# Altium project 扩展.PrjPCB (part 2 of 2)

## Sheet 十六继电器.SchDoc: 阿波罗十六继电器控制器
size A4; Revision: V1.1; SheetNumber: 0; SheetTotal: 0
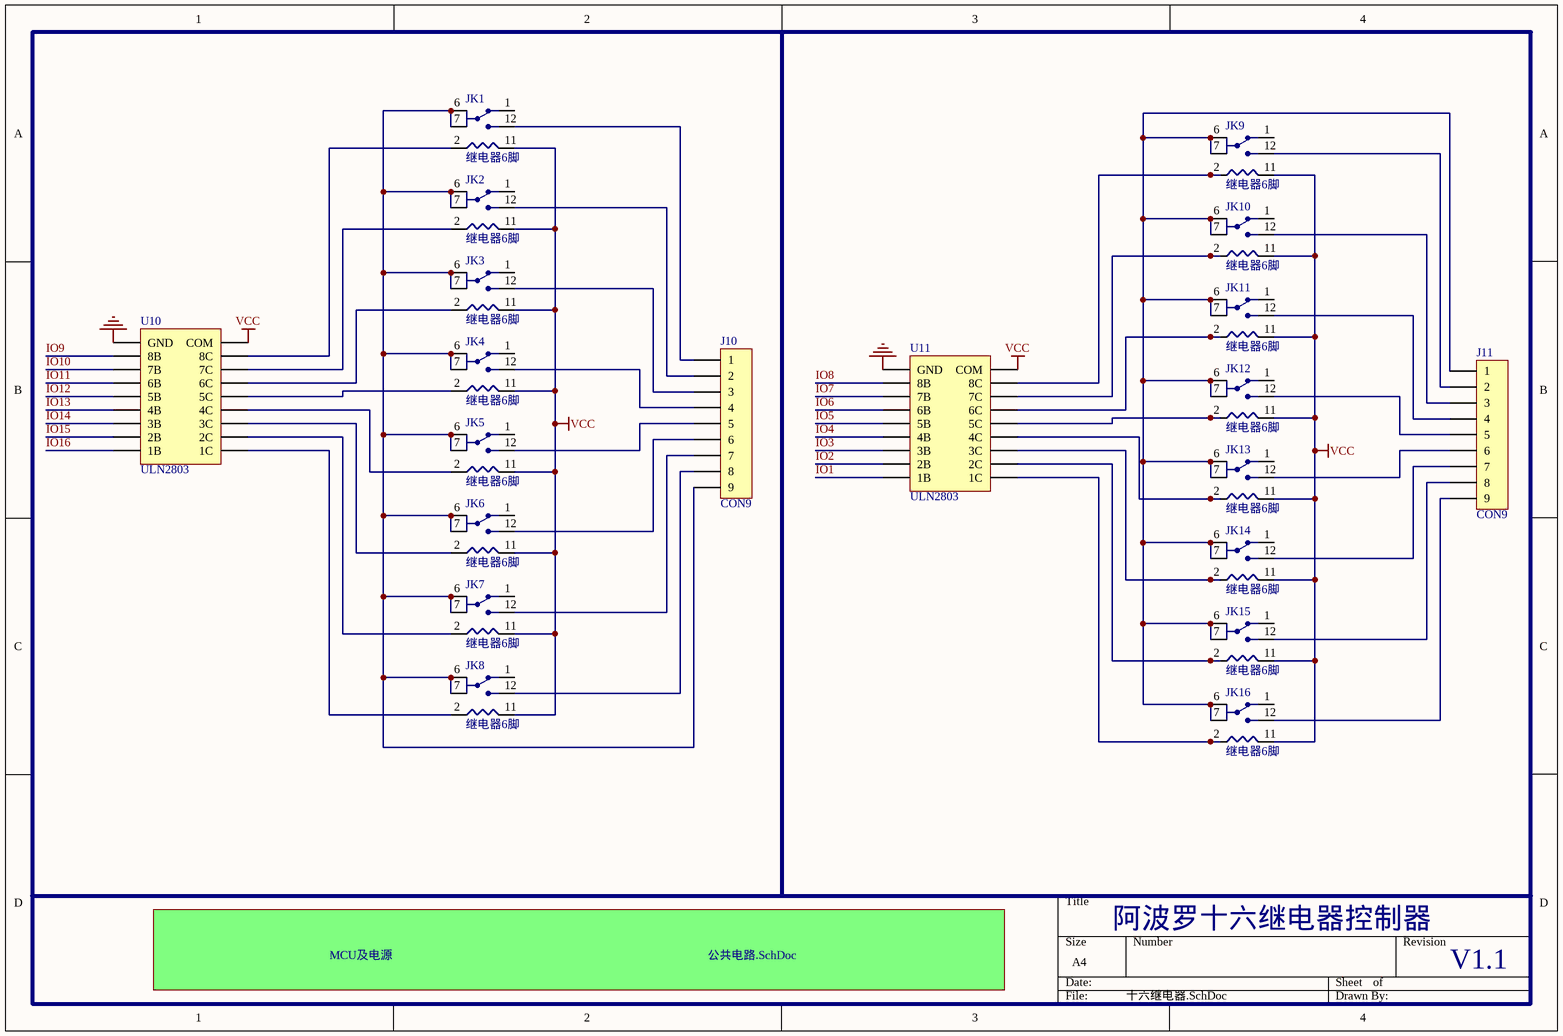
[diagram p8: 十六继电器.SchDoc]

### Parts
(Parts that share a designator on the sheet are numbered #1, #2 ... from top to bottom, then left to right.)
J10#4  CON9  [CON9*5.1]
J11#4  CON9  [CON9*5.1]
JK1  继电器6脚  [RL]
JK2  继电器6脚  [RL]
JK3  继电器6脚  [RL]
JK4  继电器6脚  [RL]
JK5  继电器6脚  [RL]
JK6  继电器6脚  [RL]
JK7  继电器6脚  [RL]
JK8  继电器6脚  [RL]
JK9  继电器6脚  [RL]
JK10  继电器6脚  [RL]
JK11  继电器6脚  [RL]
JK12  继电器6脚  [RL]
JK13  继电器6脚  [RL]
JK14  继电器6脚  [RL]
JK15  继电器6脚  [RL]
JK16  继电器6脚  [RL]
U10#3  ULN2803  [sol18]
U11#3  ULN2803  [sol18]

### Sub-sheets
MCU及电源 = 公共电路.SchDoc: no entries

### Nets
GND: U10#3.9(GND) U11#3.9(GND)
VCC: JK1.11 JK2.11 JK3.11 JK4.11 JK5.11 JK6.11 JK7.11 JK8.11 JK9.11 JK10.11 JK11.11 JK12.11 JK13.11 JK14.11 JK15.11 JK16.11 U10#3.10(COM) U11#3.10(COM)
IO1: U11#3.1(1B)
IO2: U11#3.2(2B)
IO3: U11#3.3(3B)
IO4: U11#3.4(4B)
IO5: U11#3.5(5B)
IO6: U11#3.6(6B)
IO7: U11#3.7(7B)
IO8: U11#3.8(8B)
IO9: U10#3.8(8B)
IO10: U10#3.7(7B)
IO11: U10#3.6(6B)
IO12: U10#3.5(5B)
IO13: U10#3.4(4B)
IO14: U10#3.3(3B)
IO15: U10#3.2(2B)
IO16: U10#3.1(1B)
NetJ10#4_1: J10#4.1 JK1.12
NetJ10#4_2: J10#4.2 JK2.12
NetJ10#4_3: J10#4.3 JK3.12
NetJ10#4_4: J10#4.4 JK4.12
NetJ10#4_5: J10#4.5 JK5.12
NetJ10#4_6: J10#4.6 JK6.12
NetJ10#4_7: J10#4.7 JK7.12
NetJ10#4_8: J10#4.8 JK8.12
NetJ10#4_9: J10#4.9 JK1.6 JK1.7 JK2.6 JK2.7 JK3.6 JK3.7 JK4.6 JK4.7 JK5.6 JK5.7 JK6.6 JK6.7 JK7.6 JK7.7 JK8.6 JK8.7
NetJ11#4_1: J11#4.1 JK9.6 JK9.7 JK10.6 JK10.7 JK11.6 JK11.7 JK12.6 JK12.7 JK13.6 JK13.7 JK14.6 JK14.7 JK15.6 JK15.7 JK16.6 JK16.7
NetJ11#4_2: J11#4.2 JK9.12
NetJ11#4_3: J11#4.3 JK10.12
NetJ11#4_4: J11#4.4 JK11.12
NetJ11#4_5: J11#4.5 JK12.12
NetJ11#4_6: J11#4.6 JK13.12
NetJ11#4_7: J11#4.7 JK14.12
NetJ11#4_8: J11#4.8 JK15.12
NetJ11#4_9: J11#4.9 JK16.12
NetJK1_2: JK1.2 U10#3.11(8C)
NetJK2_2: JK2.2 U10#3.12(7C)
NetJK3_2: JK3.2 U10#3.13(6C)
NetJK4_2: JK4.2 U10#3.14(5C)
NetJK5_2: JK5.2 U10#3.15(4C)
NetJK6_2: JK6.2 U10#3.16(3C)
NetJK7_2: JK7.2 U10#3.17(2C)
NetJK8_2: JK8.2 U10#3.18(1C)
NetJK9_2: JK9.2 U11#3.11(8C)
NetJK10_2: JK10.2 U11#3.12(7C)
NetJK11_2: JK11.2 U11#3.13(6C)
NetJK12_2: JK12.2 U11#3.14(5C)
NetJK13_2: JK13.2 U11#3.15(4C)
NetJK14_2: JK14.2 U11#3.16(3C)
NetJK15_2: JK15.2 U11#3.17(2C)
NetJK16_2: JK16.2 U11#3.18(1C)

Not connected (* = marked no-connect by the designer): JK1 1; JK2 1; JK3 1; JK4 1; JK5 1; JK6 1; JK7 1; JK8 1; JK9 1; JK10 1; JK11 1; JK12 1; JK13 1; JK14 1; JK15 1; JK16 1

## Sheet 电机控制.SchDoc: 阿波罗工业控制器四电机六进六出控制器电路
size A4; Revision: V1.4; SheetNumber: 0; SheetTotal: 0
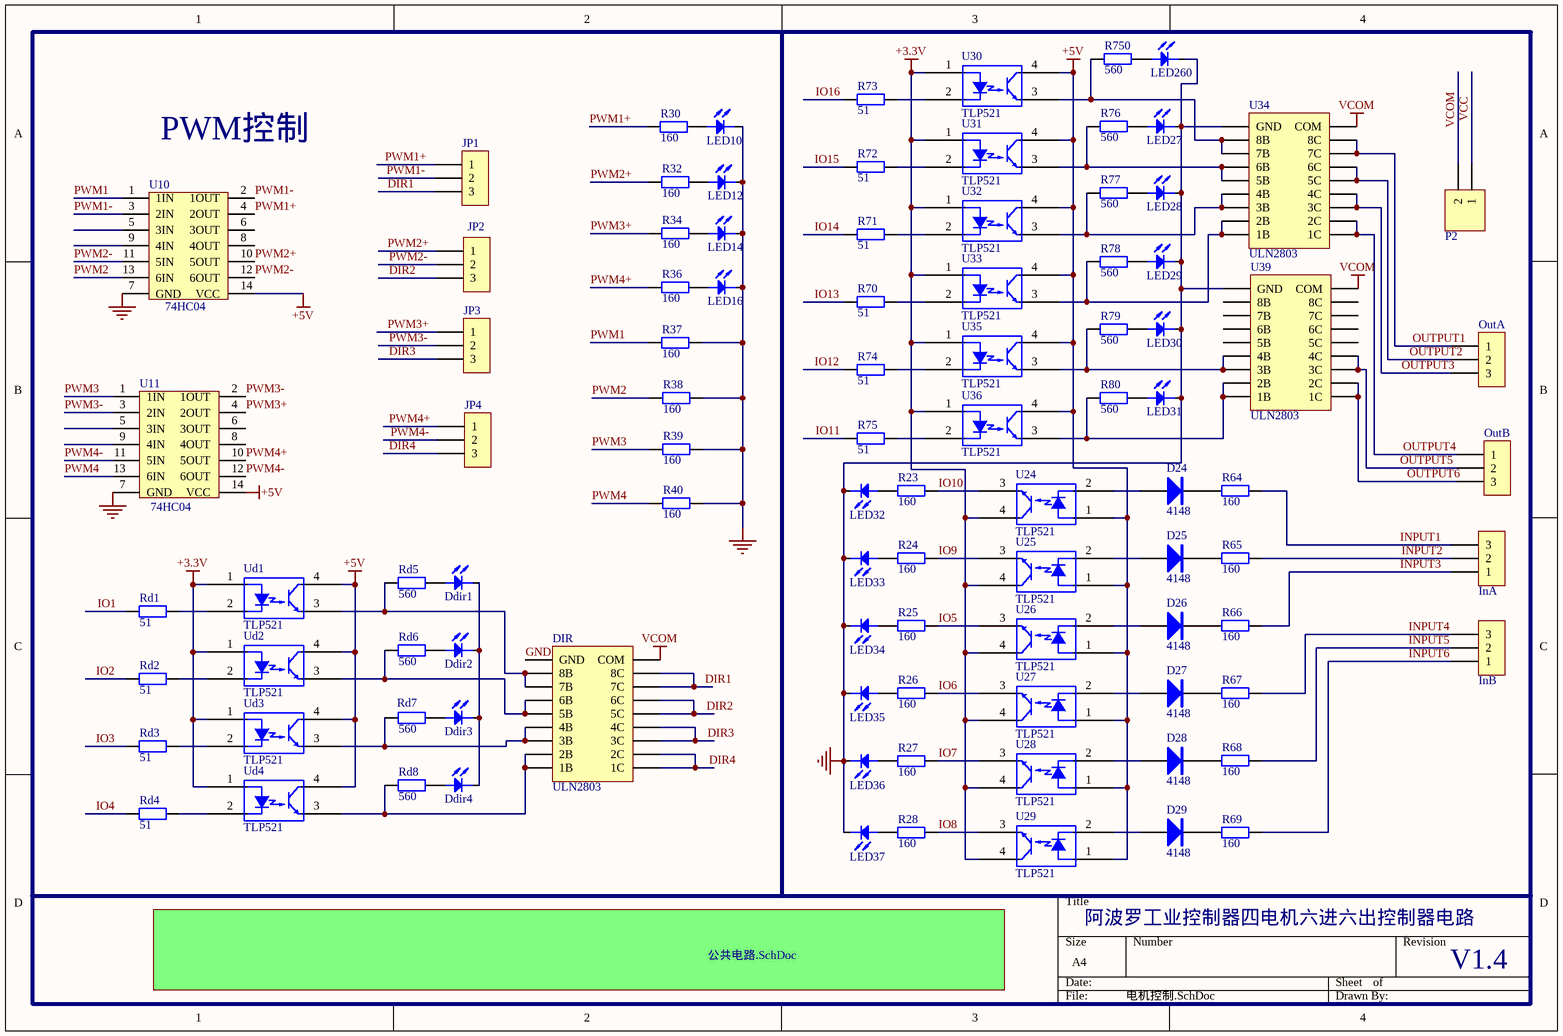
[diagram p9: 电机控制.SchDoc]

### Parts
(Parts that share a designator on the sheet are numbered #1, #2 ... from top to bottom, then left to right.)
D24#2  4148
D25#2  4148
D26#2  4148
D27#2  4148
D28#1  4148
D29#1  4148
Ddir1  LED  [SMDLED]  (value not drawn)
Ddir2  LED  [SMDLED]  (value not drawn)
Ddir3  LED  [SMDLED]  (value not drawn)
Ddir4  LED  [SMDLED]  (value not drawn)
DIR  ULN2803  [sol18]
InA  CON3  (value not drawn)
InB  CON3  (value not drawn)
JP1  CON3  (value not drawn)
JP2  CON3  (value not drawn)
JP3  CON3  (value not drawn)
JP4  CON3  (value not drawn)
LED10#4  LED  [SMDLED]  (value not drawn)
LED12#4  LED  [SMDLED]  (value not drawn)
LED14#4  LED  [SMDLED]  (value not drawn)
LED16#4  LED  [SMDLED]  (value not drawn)
LED27  LED  [SMDLED]  (value not drawn)
LED28  LED  [SMDLED]  (value not drawn)
LED29  LED  [SMDLED]  (value not drawn)
LED30#4  LED  [SMDLED]  (value not drawn)
LED31#4  LED  [SMDLED]  (value not drawn)
LED32#4  LED  [SMDLED]  (value not drawn)
LED33#4  LED  [SMDLED]  (value not drawn)
LED34#4  LED  [SMDLED]  (value not drawn)
LED35#4  LED  [SMDLED]  (value not drawn)
LED36#4  LED  [SMDLED]  (value not drawn)
LED37#4  LED  [SMDLED]  (value not drawn)
LED260  LED  [SMDLED]  (value not drawn)
OutA  CON3  (value not drawn)
OutB  CON3  (value not drawn)
P2#1  (no value)  [HDR1X2]
R23#4  160  [0603A]
R24#4  160  [0603A]
R25#4  160  [0603A]
R26#4  160  [0603A]
R27#4  160  [0603A]
R28#4  160  [0603A]
R30#4  160  [0603A]
R32#4  160  [0603A]
R34#4  160  [0603A]
R36#4  160  [0603A]
R37#4  160  [0603A]
R38#2  160  [0603A]
R39#2  160  [0603A]
R40#1  160  [0603A]
R64#2  160  [0603A]
R65#2  160  [0603A]
R66#2  160  [0603A]
R67#2  160  [0603A]
R68#1  160  [0603A]
R69#1  160  [0603A]
R70#3  51  [0603A]
R71#3  51  [0603A]
R72#3  51  [0603A]
R73#3  51  [0603A]
R74#3  51  [0603A]
R75#3  51  [0603A]
R76#3  560  [0603A]
R77#3  560  [0603A]
R78  560  [0603A]
R79  560  [0603A]
R80#2  560  [0603A]
R750  560  [0603A]
Rd1  51  [0603A]
Rd2  51  [0603A]
Rd3  51  [0603A]
Rd4  51  [0603A]
Rd5  560  [0603A]
Rd6  560  [0603A]
Rd7  560  [0603A]
Rd8  560  [0603A]
U10#4  74HC04  [so-14]
U11#4  74HC04  [so-14]
U24#2  TLP521  [PC817]
U25#2  TLP521  [PC817]
U26#2  TLP521  [PC817]
U27#2  TLP521  [PC817]
U28#1  TLP521  [PC817]
U29#1  TLP521  [PC817]
U30#3  TLP521  [PC817]
U31#3  TLP521  [PC817]
U32#3  TLP521  [PC817]
U33#3  TLP521  [PC817]
U34#3  ULN2803  [sol18]
U35#3  TLP521  [PC817]
U36#3  TLP521  [PC817]
U39#3  ULN2803  [sol18]
Ud1  TLP521  [PC817]
Ud2  TLP521  [PC817]
Ud3  TLP521  [PC817]
Ud4  TLP521  [PC817]

### Sub-sheets
? = 公共电路.SchDoc: no entries

### Nets
+3.3V: U24#2.4(COL) U25#2.4(COL) U26#2.4(COL) U27#2.4(COL) U28#1.4(COL) U29#1.4(COL) U30#3.1(ANODE) U31#3.1(ANODE) U32#3.1(ANODE) U33#3.1(ANODE) U35#3.1(ANODE) U36#3.1(ANODE) Ud1.1(ANODE) Ud2.1(ANODE) Ud3.1(ANODE) Ud4.1(ANODE)
+5V: U10#4.14(VCC) U11#4.14(VCC) U24#2.1(ANODE) U25#2.1(ANODE) U26#2.1(ANODE) U27#2.1(ANODE) U28#1.1(ANODE) U29#1.1(ANODE) U30#3.4(COL) U31#3.4(COL) U32#3.4(COL) U33#3.4(COL) U35#3.4(COL) U36#3.4(COL) Ud1.4(COL) Ud2.4(COL) Ud3.4(COL) Ud4.4(COL)
GND: DIR.9(GND) LED10#4.K LED12#4.K LED14#4.K LED16#4.K LED27.K LED28.K LED29.K LED30#4.K LED31#4.K LED32#4.K LED33#4.K LED34#4.K LED35#4.K LED36#4.K LED37#4.K LED260.K R37#4.2 R38#2.2 R39#2.2 R40#1.2 U10#4.7(GND) U11#4.7(GND) U34#3.9(GND) U39#3.9(GND)
VCC: P2#1.1
VCOM: DIR.10(COM) P2#1.2 U34#3.10(COM) U39#3.10(COM)
DIR1: DIR.11(8C) DIR.12(7C) JP1.3
DIR2: DIR.13(6C) DIR.14(5C) JP2.3
DIR3: DIR.15(4C) DIR.16(3C) JP3.3
DIR4: DIR.17(2C) DIR.18(1C) JP4.3
INPUT1: InA.3 R64#2.2
INPUT2: InA.2 R65#2.2
INPUT3: InA.1 R66#2.2
INPUT4: InB.3 R67#2.2
INPUT5: InB.2 R68#1.2
INPUT6: InB.1 R69#1.2
IO1: Rd1.1
IO2: Rd2.1
IO3: Rd3.1
IO4: Rd4.1
IO5: R25#4.1 U26#2.3(EMIT)
IO6: R26#4.1 U27#2.3(EMIT)
IO7: R27#4.1 U28#1.3(EMIT)
IO8: R28#4.1 U29#1.3(EMIT)
IO9: R24#4.1 U25#2.3(EMIT)
IO10: R23#4.1 U24#2.3(EMIT)
IO11: R75#3.1
IO12: R74#3.1
IO13: R70#3.1
IO14: R71#3.1
IO15: R72#3.1
IO16: R73#3.1
OUTPUT1: OutA.1 U34#3.11(8C) U34#3.12(7C)
OUTPUT2: OutA.2 U34#3.13(6C) U34#3.14(5C)
OUTPUT3: OutA.3 U34#3.15(4C) U34#3.16(3C)
OUTPUT4: OutB.1 U34#3.17(2C) U34#3.18(1C)
OUTPUT5: OutB.2 U39#3.15(4C) U39#3.16(3C)
OUTPUT6: OutB.3 U39#3.17(2C) U39#3.18(1C)
PWM1: R37#4.1 U10#4.1(1IN)
PWM1+: JP1.1 R30#4.1 U10#4.4(2OUT)
PWM1-: JP1.2 U10#4.2(1OUT) U10#4.3(2IN)
PWM2: R38#2.1 U10#4.13(6IN)
PWM2+: JP2.1 R32#4.1 U10#4.10(5OUT)
PWM2-: JP2.2 U10#4.11(5IN) U10#4.12(6OUT)
PWM3: R39#2.1 U11#4.1(1IN)
PWM3+: JP3.1 R34#4.1 U11#4.4(2OUT)
PWM3-: JP3.2 U11#4.2(1OUT) U11#4.3(2IN)
PWM4: R40#1.1 U11#4.13(6IN)
PWM4+: JP4.1 R36#4.1 U11#4.10(5OUT)
PWM4-: JP4.2 U11#4.11(5IN) U11#4.12(6OUT)
NetD24#2_A: D24#2.A U24#2.2(CATH)
NetD24#2_K: D24#2.K R64#2.1
NetD25#2_A: D25#2.A U25#2.2(CATH)
NetD25#2_K: D25#2.K R65#2.1
NetD26#2_A: D26#2.A U26#2.2(CATH)
NetD26#2_K: D26#2.K R66#2.1
NetD27#2_A: D27#2.A U27#2.2(CATH)
NetD27#2_K: D27#2.K R67#2.1
NetD28#1_A: D28#1.A U28#1.2(CATH)
NetD28#1_K: D28#1.K R68#1.1
NetD29#1_A: D29#1.A U29#1.2(CATH)
NetD29#1_K: D29#1.K R69#1.1
NetDdir1_A: Ddir1.A Rd5.2
NetDdir1_K: Ddir1.K Ddir2.K Ddir3.K Ddir4.K
NetDdir2_A: Ddir2.A Rd6.2
NetDdir3_A: Ddir3.A Rd7.2
NetDdir4_A: Ddir4.A Rd8.2
NetDIR_1: DIR.1(1B) DIR.2(2B) Rd8.1 Ud4.3(EMIT)
NetDIR_3: DIR.3(3B) DIR.4(4B) Rd7.1 Ud3.3(EMIT)
NetDIR_5: DIR.5(5B) DIR.6(6B) Rd6.1 Ud2.3(EMIT)
NetDIR_7: DIR.7(7B) DIR.8(8B) Rd5.1 Ud1.3(EMIT)
NetLED10#4_A: LED10#4.A R30#4.2
NetLED12#4_A: LED12#4.A R32#4.2
NetLED14#4_A: LED14#4.A R34#4.2
NetLED16#4_A: LED16#4.A R36#4.2
NetLED27_A: LED27.A R76#3.2
NetLED28_A: LED28.A R77#3.2
NetLED29_A: LED29.A R78.2
NetLED30#4_A: LED30#4.A R79.2
NetLED31#4_A: LED31#4.A R80#2.2
NetLED32#4_A: LED32#4.A R23#4.2
NetLED33#4_A: LED33#4.A R24#4.2
NetLED34#4_A: LED34#4.A R25#4.2
NetLED35#4_A: LED35#4.A R26#4.2
NetLED36#4_A: LED36#4.A R27#4.2
NetLED37#4_A: LED37#4.A R28#4.2
NetLED260_A: LED260.A R750.2
NetR70#3_2: R70#3.2 U33#3.2(CATH)
NetR71#3_2: R71#3.2 U32#3.2(CATH)
NetR72#3_2: R72#3.2 U31#3.2(CATH)
NetR73#3_2: R73#3.2 U30#3.2(CATH)
NetR74#3_2: R74#3.2 U35#3.2(CATH)
NetR75#3_2: R75#3.2 U36#3.2(CATH)
NetR76#3_1: R76#3.1 U31#3.3(EMIT) U34#3.5(5B) U34#3.6(6B)
NetR77#3_1: R77#3.1 U32#3.3(EMIT) U34#3.3(3B) U34#3.4(4B)
NetR78_1: R78.1 U33#3.3(EMIT) U34#3.1(1B) U34#3.2(2B)
NetR79_1: R79.1 U35#3.3(EMIT) U39#3.3(3B) U39#3.4(4B)
NetR80#2_1: R80#2.1 U36#3.3(EMIT) U39#3.1(1B) U39#3.2(2B)
NetR750_1: R750.1 U30#3.3(EMIT) U34#3.7(7B) U34#3.8(8B)
NetRd1_2: Rd1.2 Ud1.2(CATH)
NetRd2_2: Rd2.2 Ud2.2(CATH)
NetRd3_2: Rd3.2 Ud3.2(CATH)
NetRd4_2: Rd4.2 Ud4.2(CATH)

Not connected (* = marked no-connect by the designer): U10#4 5(3IN) 6(3OUT) 8(4OUT) 9(4IN); U11#4 5(3IN) 6(3OUT) 8(4OUT) 9(4IN); U39#3 5(5B) 6(6B) 7(7B) 8(8B) 11(8C) 12(7C) 13(6C) 14(5C)

### Notes on the sheet
- (near U10#4) PWM控制

### Library data of the parts
P2#1 = Header 2: Header, 2-Pin; LatestRevisionDate: 17-Jul-2002; LatestRevisionNote: Re-released for DXP Platform.; Publisher: Altium Limited
R23#4 R24#4 R25#4 R26#4 R27#4 R28#4 R30#4 R32#4 R34#4 R36#4 R37#4 R38#2 R39#2 R40#1 R64#2 R65#2 R66#2 R67#2 R68#1 R69#1 R70#3 R71#3 R72#3 R73#3 R74#3 R75#3 R76#3 R77#3 R78 R79 R80#2 R750 Rd1-Rd8 = Res2: Resistor; Value: 1K; Published: 8-Jun-2000; LatestRevisionDate: 17-Jul-2002; LatestRevisionNote: Re-released for DXP Platform.; PackageReference: AXIAL-0.4; Publisher: Altium Limited
U24#2 U25#2 U26#2 U27#2 U28#1 U29#1 U30#3 U31#3 U32#3 U33#3 U35#3 U36#3 Ud1-Ud4 = TLP521-1: Single NPN PhotoTransistor OptoCoupler.

## Sheet 模拟量.SchDoc: 阿波罗模拟量控制器
size A4; Revision: V1.1; SheetNumber: 0; SheetTotal: 0
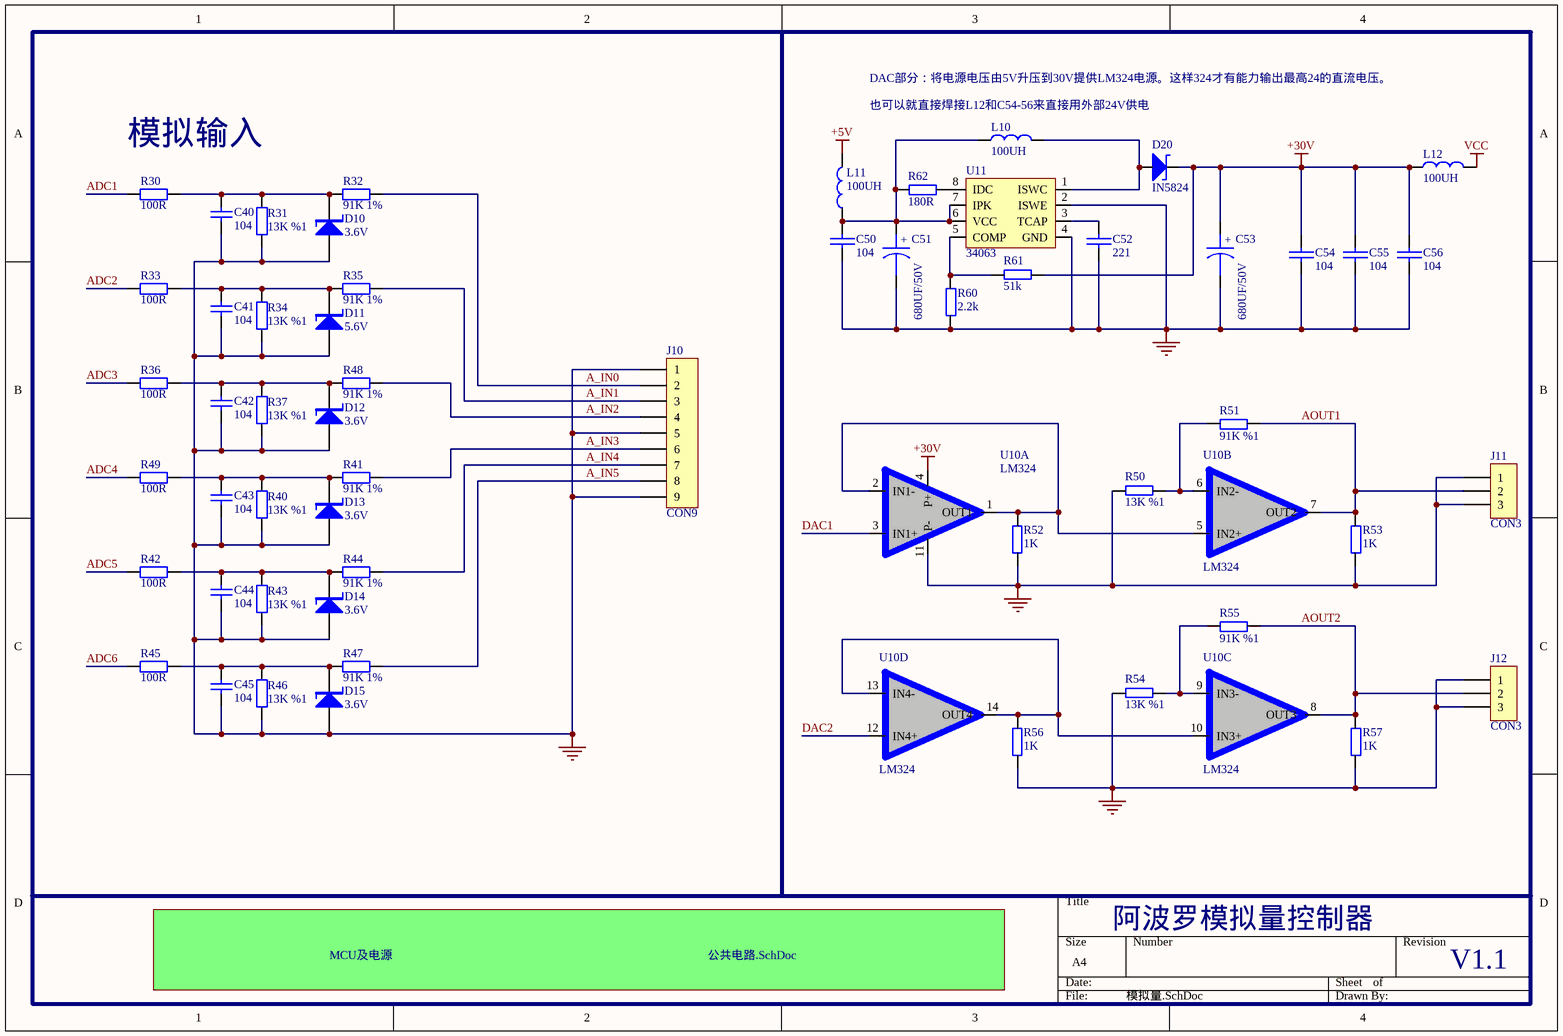
[diagram p10: 模拟量.SchDoc]

### Parts
(Parts that share a designator on the sheet are numbered #1, #2 ... from top to bottom, then left to right.)
C40  104  [0603A]
C41  104  [0603A]
C42  104  [0603A]
C43  104  [0603A]
C44  104  [0603A]
C45  104  [0603A]
C50  104  [0603A]
C51  680UF/50V  [电解电容]
C52  221  [0603A]
C53  680UF/50V  [电解电容]
C54  104  [0603A]
C55  104  [0603A]
C56  104  [0603A]
D10#3  3.6V  [贴片二极管]
D11#3  5.6V  [贴片二极管]
D12#3  3.6V  [贴片二极管]
D13#3  3.6V  [贴片二极管]
D14#3  3.6V  [贴片二极管]
D15#3  3.6V  [贴片二极管]
D20#2  IN5824  [贴片二极管]
J10#5  CON9  [CON9-5.1卧]
J11#5  CON3  [CON3-5.1卧]
J12  CON3  [CON3-5.1卧]
L10  100UH  [SMD-50]
L11  100UH  [1206C]
L12  100UH  [1206C]
R30#5  100R  [0603A]
R31#4  13K %1  [0603A]
R32#5  91K 1%  [0603A]
R33#4  100R  [0603A]
R34#5  13K %1  [0603A]
R35#4  91K 1%  [0603A]
R36#5  100R  [0603A]
R37#5  13K %1  [0603A]
R40#2  13K %1  [0603A]
R41  91K 1%  [0603A]
R42  100R  [0603A]
R43#1  13K %1  [0603A]
R44#1  91K 1%  [0603A]
R45#1  100R  [0603A]
R46#1  13K %1  [0603A]
R47#1  91K 1%  [0603A]
R48#1  91K 1%  [0603A]
R49#3  100R  [0603A]
R50#3  13K %1  [0603A]
R51#3  91K %1  [0603A]
R52#3  1K  [0603A]
R53#3  1K  [0603A]
R54#3  13K %1  [0603A]
R55#3  91K %1  [0603A]
R56#3  1K  [0603A]
R57#3  1K  [0603A]
R60#2  2.2k  [0603A]
R61#2  51k  [0603A]
R62#2  180R  [0603A]
U10#5  LM324  [SO-14]  (parts A,B,C,D of 4)
U11#5  34063  [SO8_L]

### Sub-sheets
MCU及电源 = 公共电路.SchDoc: no entries

### Nets
+5V: L11.1
+30V: C53.1 C54.1 C55.1 C56.1 D20#2.K L12.2 R61#2.1 U10#5.4(P+)
GND: C40.1 C41.1 C42.1 C43.1 C44.1 C45.1 C50.2 C51.2 C52.2 C53.2 C54.2 C55.2 C56.2 D10#3.A D11#3.A D12#3.A D13#3.A D14#3.A D15#3.A J10#5.1 J10#5.5 J10#5.9 J11#5.1 J11#5.3 J12.1 J12.3 R31#4.1 R34#5.1 R37#5.1 R40#2.1 R43#1.1 R46#1.1 R50#3.2 R52#3.2 R53#3.1 R54#3.2 R56#3.2 R57#3.1 R60#2.1 U10#5.11(P-) U11#5.2(ISWE) U11#5.4(GND)
VCC: L12.1
A_IN0: J10#5.2 R32#5.1
A_IN1: J10#5.3 R35#4.1
A_IN2: J10#5.4 R48#1.1
A_IN3: J10#5.6 R41.1
A_IN4: J10#5.7 R44#1.1
A_IN5: J10#5.8 R47#1.1
ADC1: R30#5.1
ADC2: R33#4.1
ADC3: R36#5.1
ADC4: R49#3.1
ADC5: R42.1
ADC6: R45#1.1
AOUT1: J11#5.2 R51#3.2 R53#3.2 U10#5.7(OUT2)
AOUT2: J12.2 R55#3.2 R57#3.2 U10#5.8(OUT3)
DAC1: U10#5.3(IN1+)
DAC2: U10#5.12(IN4+)
NetC40_2: C40.2 D10#3.K R30#5.2 R31#4.2 R32#5.2
NetC41_2: C41.2 D11#3.K R33#4.2 R34#5.2 R35#4.2
NetC42_2: C42.2 D12#3.K R36#5.2 R37#5.2 R48#1.2
NetC43_2: C43.2 D13#3.K R40#2.2 R41.2 R49#3.2
NetC44_2: C44.2 D14#3.K R42.2 R43#1.2 R44#1.2
NetC45_2: C45.2 D15#3.K R45#1.2 R46#1.2 R47#1.2
NetC50_1: C50.1 C51.1 L10.2 L11.2 R62#2.1 U11#5.6(VCC) U11#5.7(IPK)
NetC52_1: C52.1 U11#5.3(TCAP)
NetD20#2_A: D20#2.A L10.1 U11#5.1(ISWC)
NetR50#3_1: R50#3.1 R51#3.1 U10#5.6(IN2-)
NetR52#3_1: R52#3.1 U10#5.1(OUT1) U10#5.2(IN1-) U10#5.5(IN2+)
NetR54#3_1: R54#3.1 R55#3.1 U10#5.9(IN3-)
NetR56#3_1: R56#3.1 U10#5.10(IN3+) U10#5.13(IN4-) U10#5.14(OUT4)
NetR60#2_2: R60#2.2 R61#2.2 U11#5.5(COMP)
NetR62#2_2: R62#2.2 U11#5.8(IDC)

### Notes on the sheet
- DAC部分：将电源电压由5V升压到30V提供LM324电源。这样324才有能力输出最高24的直流电压。
- (near L10) 也可以就直接焊接L12和C54-56来直接用外部24V供电
- 模拟输入
- (in symbol CAPACITOR POL) +

### Library data of the parts
C40-C45 = Cap_1: Capacitor; Value: 100pF; Published: 8-Jun-2000; LatestRevisionDate: 17-Jul-2002; LatestRevisionNote: Re-released for DXP Platform.; PackageReference: RAD-0.3; Publisher: Altium Limited
C50 C52 C54-C56 = CAP: Capacitor
C51 C53 = CAPACITOR POL: Capacitor
D10#3 D11#3 D12#3 D13#3 D14#3 D15#3 = 稳压二极管
D20#2 = 肖特基二极管
L10-L12 = L1
R30#5 R31#4 R32#5 R33#4 R34#5 R35#4 R36#5 R37#5 R40#2 R41 R42 R43#1 R44#1 R45#1 R46#1 R47#1 R48#1 R49#3 = Res2: Resistor; Value: 1K; Published: 8-Jun-2000; LatestRevisionDate: 17-Jul-2002; LatestRevisionNote: Re-released for DXP Platform.; PackageReference: AXIAL-0.4; Publisher: Altium Limited
R50#3 R51#3 R52#3 R53#3 R54#3 R55#3 R56#3 R57#3 R60#2 R61#2 R62#2 = R

## Sheet 四进四出三电机.SchDoc: 阿波罗混胶机控制器
size A4; Revision: V1.2; SheetNumber: 0; SheetTotal: 0
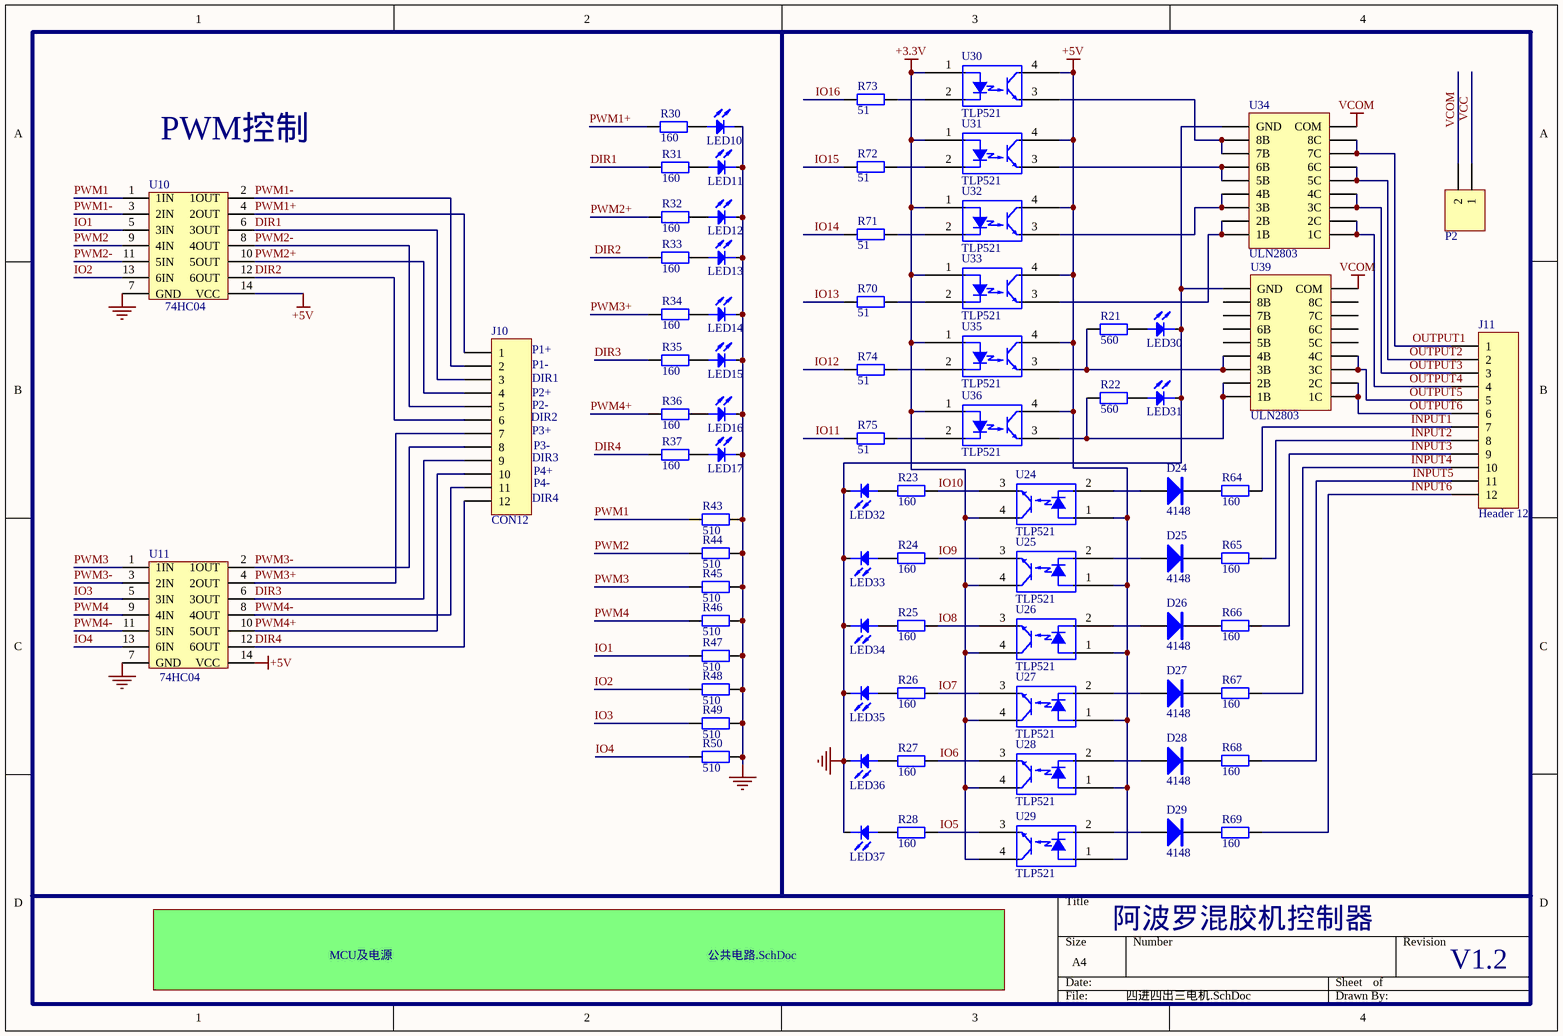
[diagram p11: 四进四出三电机.SchDoc]

### Parts
(Parts that share a designator on the sheet are numbered #1, #2 ... from top to bottom, then left to right.)
D24#3  4148  [贴片二极管]
D25#3  4148  [贴片二极管]
D26#3  4148  [贴片二极管]
D27#3  4148  [贴片二极管]
D28#2  4148  [贴片二极管]
D29#2  4148  [贴片二极管]
J10#6  CON12  [CON12-5.1卧]
J11#6  Header 12  [CON12-5.1卧]
LED10#5  LED  [LED2.5]  (value not drawn)
LED11#4  LED  [LED2.5]  (value not drawn)
LED12#5  LED  [LED2.5]  (value not drawn)
LED13#4  LED  [LED2.5]  (value not drawn)
LED14#5  LED  [LED2.5]  (value not drawn)
LED15#4  LED  [LED2.5]  (value not drawn)
LED16#5  LED  [LED2.5]  (value not drawn)
LED17#4  LED  [LED2.5]  (value not drawn)
LED30#5  LED  [LED2.5]  (value not drawn)
LED31#5  LED  [LED2.5]  (value not drawn)
LED32#5  LED  [LED2.5]  (value not drawn)
LED33#5  LED  [LED2.5]  (value not drawn)
LED34#5  LED  [LED2.5]  (value not drawn)
LED35#5  LED  [LED2.5]  (value not drawn)
LED36#5  LED  [LED2.5]  (value not drawn)
LED37#5  LED  [LED2.5]  (value not drawn)
P2#2  (no value)  [HDR1X2]
R21#5  560  [0603A]
R22#4  560  [0603A]
R23#5  160  [0603A]
R24#5  160  [0603A]
R25#5  160  [0603A]
R26#5  160  [0603A]
R27#5  160  [0603A]
R28#5  160  [0603A]
R30#6  160  [0603A]
R31#5  160  [0603A]
R32#6  160  [0603A]
R33#5  160  [0603A]
R34#6  160  [0603A]
R35#5  160  [0603A]
R36#6  160  [0603A]
R37#6  160  [0603A]
R43#2  510  [0603A]
R44#2  510  [0603A]
R45#2  510  [0603A]
R46#2  510  [0603A]
R47#2  510  [0603A]
R48#2  510  [0603A]
R49#4  510  [0603A]
R50#4  510  [0603A]
R64#3  160  [0603A]
R65#3  160  [0603A]
R66#3  160  [0603A]
R67#3  160  [0603A]
R68#2  160  [0603A]
R69#2  160  [0603A]
R70#4  51  [0603A]
R71#4  51  [0603A]
R72#4  51  [0603A]
R73#4  51  [0603A]
R74#4  51  [0603A]
R75#4  51  [0603A]
U10#6  74HC04  [so-14]
U11#6  74HC04  [so-14]
U24#3  TLP521  [PC817]
U25#3  TLP521  [PC817]
U26#3  TLP521  [PC817]
U27#3  TLP521  [PC817]
U28#2  TLP521  [PC817]
U29#2  TLP521  [PC817]
U30#4  TLP521  [PC817]
U31#4  TLP521  [PC817]
U32#4  TLP521  [PC817]
U33#4  TLP521  [PC817]
U34#4  ULN2803  [sol18]
U35#4  TLP521  [PC817]
U36#4  TLP521  [PC817]
U39#4  ULN2803  [sol18]

### Sub-sheets
MCU及电源 = 公共电路.SchDoc: no entries

### Nets
+3.3V: U24#3.4(COL) U25#3.4(COL) U26#3.4(COL) U27#3.4(COL) U28#2.4(COL) U29#2.4(COL) U30#4.1(ANODE) U31#4.1(ANODE) U32#4.1(ANODE) U33#4.1(ANODE) U35#4.1(ANODE) U36#4.1(ANODE)
+5V: U10#6.14(VCC) U11#6.14(VCC) U24#3.1(ANODE) U25#3.1(ANODE) U26#3.1(ANODE) U27#3.1(ANODE) U28#2.1(ANODE) U29#2.1(ANODE) U30#4.4(COL) U31#4.4(COL) U32#4.4(COL) U33#4.4(COL) U35#4.4(COL) U36#4.4(COL)
GND: LED10#5.K LED11#4.K LED12#5.K LED13#4.K LED14#5.K LED15#4.K LED16#5.K LED17#4.K LED30#5.K LED31#5.K LED32#5.K LED33#5.K LED34#5.K LED35#5.K LED36#5.K LED37#5.K R43#2.2 R44#2.2 R45#2.2 R46#2.2 R47#2.2 R48#2.2 R49#4.2 R50#4.2 U10#6.7(GND) U11#6.7(GND) U34#4.9(GND) U39#4.9(GND)
VCC: P2#2.1
VCOM: P2#2.2 U34#4.10(COM) U39#4.10(COM)
DIR1: J10#6.3 R31#5.1 U10#6.6(3OUT)
DIR2: J10#6.6 R33#5.1 U10#6.12(6OUT)
DIR3: J10#6.9 R35#5.1 U11#6.6(3OUT)
DIR4: J10#6.12 R37#6.1 U11#6.12(6OUT)
INPUT1: J11#6.7 R64#3.2
INPUT2: J11#6.8 R65#3.2
INPUT3: J11#6.9 R66#3.2
INPUT4: J11#6.10 R67#3.2
INPUT5: J11#6.11 R68#2.2
INPUT6: J11#6.12 R69#2.2
IO1: R47#2.1 U10#6.5(3IN)
IO2: R48#2.1 U10#6.13(6IN)
IO3: R49#4.1 U11#6.5(3IN)
IO4: R50#4.1 U11#6.13(6IN)
IO5: R28#5.1 U29#2.3(EMIT)
IO6: R27#5.1 U28#2.3(EMIT)
IO7: R26#5.1 U27#3.3(EMIT)
IO8: R25#5.1 U26#3.3(EMIT)
IO9: R24#5.1 U25#3.3(EMIT)
IO10: R23#5.1 U24#3.3(EMIT)
IO11: R75#4.1
IO12: R74#4.1
IO13: R70#4.1
IO14: R71#4.1
IO15: R72#4.1
IO16: R73#4.1
OUTPUT1: J11#6.1 U34#4.11(8C) U34#4.12(7C)
OUTPUT2: J11#6.2 U34#4.13(6C) U34#4.14(5C)
OUTPUT3: J11#6.3 U34#4.15(4C) U34#4.16(3C)
OUTPUT4: J11#6.4 U34#4.17(2C) U34#4.18(1C)
OUTPUT5: J11#6.5 U39#4.15(4C) U39#4.16(3C)
OUTPUT6: J11#6.6 U39#4.17(2C) U39#4.18(1C)
PWM1: R43#2.1 U10#6.1(1IN)
PWM1+: J10#6.1 R30#6.1 U10#6.4(2OUT)
PWM1-: J10#6.2 U10#6.2(1OUT) U10#6.3(2IN)
PWM2: R44#2.1 U10#6.9(4IN)
PWM2+: J10#6.4 R32#6.1 U10#6.10(5OUT)
PWM2-: J10#6.5 U10#6.8(4OUT) U10#6.11(5IN)
PWM3: R45#2.1 U11#6.1(1IN)
PWM3+: J10#6.7 R34#6.1 U11#6.4(2OUT)
PWM3-: J10#6.8 U11#6.2(1OUT) U11#6.3(2IN)
PWM4: R46#2.1 U11#6.9(4IN)
PWM4+: J10#6.10 R36#6.1 U11#6.10(5OUT)
PWM4-: J10#6.11 U11#6.8(4OUT) U11#6.11(5IN)
NetD24#3_A: D24#3.A U24#3.2(CATH)
NetD24#3_K: D24#3.K R64#3.1
NetD25#3_A: D25#3.A U25#3.2(CATH)
NetD25#3_K: D25#3.K R65#3.1
NetD26#3_A: D26#3.A U26#3.2(CATH)
NetD26#3_K: D26#3.K R66#3.1
NetD27#3_A: D27#3.A U27#3.2(CATH)
NetD27#3_K: D27#3.K R67#3.1
NetD28#2_A: D28#2.A U28#2.2(CATH)
NetD28#2_K: D28#2.K R68#2.1
NetD29#2_A: D29#2.A U29#2.2(CATH)
NetD29#2_K: D29#2.K R69#2.1
NetLED10#5_A: LED10#5.A R30#6.2
NetLED11#4_A: LED11#4.A R31#5.2
NetLED12#5_A: LED12#5.A R32#6.2
NetLED13#4_A: LED13#4.A R33#5.2
NetLED14#5_A: LED14#5.A R34#6.2
NetLED15#4_A: LED15#4.A R35#5.2
NetLED16#5_A: LED16#5.A R36#6.2
NetLED17#4_A: LED17#4.A R37#6.2
NetLED30#5_A: LED30#5.A R21#5.2
NetLED31#5_A: LED31#5.A R22#4.2
NetLED32#5_A: LED32#5.A R23#5.2
NetLED33#5_A: LED33#5.A R24#5.2
NetLED34#5_A: LED34#5.A R25#5.2
NetLED35#5_A: LED35#5.A R26#5.2
NetLED36#5_A: LED36#5.A R27#5.2
NetLED37#5_A: LED37#5.A R28#5.2
NetR21#5_1: R21#5.1 U35#4.3(EMIT) U39#4.3(3B) U39#4.4(4B)
NetR22#4_1: R22#4.1 U36#4.3(EMIT) U39#4.1(1B) U39#4.2(2B)
NetR70#4_2: R70#4.2 U33#4.2(CATH)
NetR71#4_2: R71#4.2 U32#4.2(CATH)
NetR72#4_2: R72#4.2 U31#4.2(CATH)
NetR73#4_2: R73#4.2 U30#4.2(CATH)
NetR74#4_2: R74#4.2 U35#4.2(CATH)
NetR75#4_2: R75#4.2 U36#4.2(CATH)
NetU30#4_3: U30#4.3(EMIT) U34#4.7(7B) U34#4.8(8B)
NetU31#4_3: U31#4.3(EMIT) U34#4.5(5B) U34#4.6(6B)
NetU32#4_3: U32#4.3(EMIT) U34#4.3(3B) U34#4.4(4B)
NetU33#4_3: U33#4.3(EMIT) U34#4.1(1B) U34#4.2(2B)

Not connected (* = marked no-connect by the designer): U39#4 5(5B) 6(6B) 7(7B) 8(8B) 11(8C) 12(7C) 13(6C) 14(5C)

### Notes on the sheet
- (near U10#6) PWM控制
- (near J10#6) P1+
- (near J10#6) P1-
- (near J10#6) DIR1
- (near J10#6) DIR2
- (near J10#6) P2-
- (near J10#6) P2+
- (near J10#6) P3+
- (near J10#6) P3-
- (near J10#6) DIR3
- (near J10#6) DIR4
- (near J10#6) P4+
- (near J10#6) P4-

### Library data of the parts
D24#3 D25#3 D26#3 D27#3 D28#2 D29#2 = 二极管
J10#6 J11#6 = Header 12: Header, 12-Pin; LatestRevisionDate: 17-Jul-2002; LatestRevisionNote: Re-released for DXP Platform.; Publisher: Altium Limited
P2#2 = Header 2: Header, 2-Pin; LatestRevisionDate: 17-Jul-2002; LatestRevisionNote: Re-released for DXP Platform.; Publisher: Altium Limited
R21#5 R22#4 R23#5 R24#5 R25#5 R26#5 R27#5 R28#5 R30#6 R31#5 R32#6 R33#5 R34#6 R35#5 R36#6 R37#6 R43#2 R44#2 R45#2 R46#2 R47#2 R48#2 R49#4 R50#4 R64#3 R65#3 R66#3 R67#3 R68#2 R69#2 R70#4 R71#4 R72#4 R73#4 R74#4 R75#4 = Res2: Resistor; Value: 1K; Published: 8-Jun-2000; LatestRevisionDate: 17-Jul-2002; LatestRevisionNote: Re-released for DXP Platform.; PackageReference: AXIAL-0.4; Publisher: Altium Limited
U24#3 U25#3 U26#3 U27#3 U28#2 U29#2 U30#4 U31#4 U32#4 U33#4 U35#4 U36#4 = TLP521-1: Single NPN PhotoTransistor OptoCoupler.

## Nets that join several sheets
+3.3V: 十二进十二出 (24 pins), 公共电路 -（十二专用）  (14 pins), 核心板 (23 pins), 电源板 (12 pins), 八进八出 (16 pins), 核心板、电源板 (14 pins), 十六路输入 (16 pins), MCU及电源 (14 pins), 十六路输出 (16 pins), MCU及电源 (14 pins), MCU及电源 (14 pins), 电机控制 (16 pins),  (14 pins), MCU及电源 (14 pins), 四进四出三电机 (12 pins), MCU及电源 (14 pins)
+5V: 十二进十二出 (12 pins), 公共电路 -（十二专用）  (16 pins), 电源板 (6 pins), 八进八出 (R49#1.2 R89#1.2), 核心板、电源板 (14 pins), 十六路输入 (R49#2.2 R59.2), MCU及电源 (14 pins), 十六路输出 (R89#2.2 R99.2), MCU及电源 (14 pins), MCU及电源 (14 pins), 电机控制 (18 pins),  (14 pins), 模拟量 (L11.1), MCU及电源 (14 pins), 四进四出三电机 (14 pins), MCU及电源 (14 pins)
GND: 十二进十二出 (27 pins), 公共电路 -（十二专用）  (48 pins), 核心板 (27 pins), 电源板 (26 pins), 八进八出 (19 pins), 核心板、电源板 (50 pins), 十六路输入 (18 pins), MCU及电源 (50 pins), 十六路输出 (22 pins), MCU及电源 (50 pins), 十六继电器 (U10#3.9 U11#3.9), MCU及电源 (50 pins), 电机控制 (25 pins),  (50 pins), 模拟量 (42 pins), MCU及电源 (50 pins), 四进四出三电机 (28 pins), MCU及电源 (50 pins)
VCC: 十二进十二出 (15 pins), 公共电路 -（十二专用）  (5 pins), 电源板 (5 pins), 核心板、电源板 (5 pins), MCU及电源 (5 pins), 十六路输出 (U34#2.10 U39#2.10 U44.10 U49.10), MCU及电源 (5 pins), 十六继电器 (18 pins), MCU及电源 (5 pins), 电机控制 (P2#1.1),  (5 pins), 模拟量 (L12.1), MCU及电源 (5 pins), 四进四出三电机 (P2#2.1), MCU及电源 (5 pins)
VCOM: 八进八出 (J11#1.1 U34#1.10 U39#1.10), 电机控制 (DIR.10 P2#1.2 U34#3.10 U39#3.10), 四进四出三电机 (P2#2.2 U34#4.10 U39#4.10)
485A: 公共电路 -（十二专用）  (COM2.2 R13.2 TM2.1), 核心板、电源板 (P1_核心板、电源板.1 R13_核心板、电源板.2 RS485_核心板、电源板.1), MCU及电源 (P1_MCU及电源#1.1 R13_MCU及电源#1.2 RS485_MCU及电源#1.1), MCU及电源 (P1_MCU及电源#2.1 R13_MCU及电源#2.2 RS485_MCU及电源#2.1), MCU及电源 (P1_MCU及电源#3.1 R13_MCU及电源#3.2 RS485_MCU及电源#3.1),  (P1_.1 R13_.2 RS485_.1), MCU及电源 (P1_MCU及电源#4.1 R13_MCU及电源#4.2 RS485_MCU及电源#4.1), MCU及电源 (P1_MCU及电源#5.1 R13_MCU及电源#5.2 RS485_MCU及电源#5.1)
485B: 公共电路 -（十二专用）  (COM2.1 R12.2 R485.2), 核心板、电源板 (R12_核心板、电源板.2 R485_核心板、电源板.2 RS485_核心板、电源板.2), MCU及电源 (R12_MCU及电源#1.2 R485_MCU及电源#1.2 RS485_MCU及电源#1.2), MCU及电源 (R12_MCU及电源#2.2 R485_MCU及电源#2.2 RS485_MCU及电源#2.2), MCU及电源 (R12_MCU及电源#3.2 R485_MCU及电源#3.2 RS485_MCU及电源#3.2),  (R12_.2 R485_.2 RS485_.2), MCU及电源 (R12_MCU及电源#4.2 R485_MCU及电源#4.2 RS485_MCU及电源#4.2), MCU及电源 (R12_MCU及电源#5.2 R485_MCU及电源#5.2 RS485_MCU及电源#5.2)
ADC1: 公共电路 -（十二专用）  (IC1.33), 核心板、电源板 (IC2_核心板、电源板.33), MCU及电源 (IC2_MCU及电源#1.33), MCU及电源 (IC2_MCU及电源#2.33), MCU及电源 (IC2_MCU及电源#3.33),  (IC2_.33), 模拟量 (R30#5.1), MCU及电源 (IC2_MCU及电源#4.33), MCU及电源 (IC2_MCU及电源#5.33)
ADC2: 公共电路 -（十二专用）  (IC1.34), 核心板、电源板 (IC2_核心板、电源板.34), MCU及电源 (IC2_MCU及电源#1.34), MCU及电源 (IC2_MCU及电源#2.34), MCU及电源 (IC2_MCU及电源#3.34),  (IC2_.34), 模拟量 (R33#4.1), MCU及电源 (IC2_MCU及电源#4.34), MCU及电源 (IC2_MCU及电源#5.34)
ADC3: 核心板、电源板 (IC2_核心板、电源板.35), MCU及电源 (IC2_MCU及电源#1.35), MCU及电源 (IC2_MCU及电源#2.35), MCU及电源 (IC2_MCU及电源#3.35),  (IC2_.35), 模拟量 (R36#5.1), MCU及电源 (IC2_MCU及电源#4.35), MCU及电源 (IC2_MCU及电源#5.35)
ADC4: 核心板、电源板 (IC2_核心板、电源板.36), MCU及电源 (IC2_MCU及电源#1.36), MCU及电源 (IC2_MCU及电源#2.36), MCU及电源 (IC2_MCU及电源#3.36),  (IC2_.36), 模拟量 (R49#3.1), MCU及电源 (IC2_MCU及电源#4.36), MCU及电源 (IC2_MCU及电源#5.36)
ADC5: 核心板、电源板 (IC2_核心板、电源板.48), MCU及电源 (IC2_MCU及电源#1.48), MCU及电源 (IC2_MCU及电源#2.48), MCU及电源 (IC2_MCU及电源#3.48),  (IC2_.48), 模拟量 (R42.1), MCU及电源 (IC2_MCU及电源#4.48), MCU及电源 (IC2_MCU及电源#5.48)
ADC6: 核心板、电源板 (IC2_核心板、电源板.47), MCU及电源 (IC2_MCU及电源#1.47), MCU及电源 (IC2_MCU及电源#2.47), MCU及电源 (IC2_MCU及电源#3.47),  (IC2_.47), 模拟量 (R45#1.1), MCU及电源 (IC2_MCU及电源#4.47), MCU及电源 (IC2_MCU及电源#5.47)
ADC7: 核心板、电源板 (IC2_核心板、电源板.50), MCU及电源 (IC2_MCU及电源#1.50), MCU及电源 (IC2_MCU及电源#2.50), MCU及电源 (IC2_MCU及电源#3.50),  (IC2_.50), MCU及电源 (IC2_MCU及电源#4.50), MCU及电源 (IC2_MCU及电源#5.50)
ADC8: 核心板、电源板 (IC2_核心板、电源板.49), MCU及电源 (IC2_MCU及电源#1.49), MCU及电源 (IC2_MCU及电源#2.49), MCU及电源 (IC2_MCU及电源#3.49),  (IC2_.49), MCU及电源 (IC2_MCU及电源#4.49), MCU及电源 (IC2_MCU及电源#5.49)
BEEP: 公共电路 -（十二专用）  (IC1.31 R14#1.2 R16#1.1), 核心板、电源板 (IC2_核心板、电源板.31 R2_核心板、电源板.1 R14_核心板、电源板.2), MCU及电源 (IC2_MCU及电源#1.31 R2_MCU及电源#1.1 R14_MCU及电源#1.2), MCU及电源 (IC2_MCU及电源#2.31 R2_MCU及电源#2.1 R14_MCU及电源#2.2), MCU及电源 (IC2_MCU及电源#3.31 R2_MCU及电源#3.1 R14_MCU及电源#3.2),  (IC2_.31 R2_.1 R14_.2), MCU及电源 (IC2_MCU及电源#4.31 R2_MCU及电源#4.1 R14_MCU及电源#4.2), MCU及电源 (IC2_MCU及电源#5.31 R2_MCU及电源#5.1 R14_MCU及电源#5.2)
BOOT: 公共电路 -（十二专用）  (IC1.3), 核心板、电源板 (IC2_核心板、电源板.3), MCU及电源 (IC2_MCU及电源#1.3), MCU及电源 (IC2_MCU及电源#2.3), MCU及电源 (IC2_MCU及电源#3.3),  (IC2_.3), MCU及电源 (IC2_MCU及电源#4.3), MCU及电源 (IC2_MCU及电源#5.3)
CAN_HO: 核心板、电源板 (5 pins), MCU及电源 (5 pins), MCU及电源 (5 pins), MCU及电源 (5 pins),  (5 pins), MCU及电源 (5 pins), MCU及电源 (5 pins)
CAN_LO: 核心板、电源板 (5 pins), MCU及电源 (5 pins), MCU及电源 (5 pins), MCU及电源 (5 pins),  (5 pins), MCU及电源 (5 pins), MCU及电源 (5 pins)
CAN_RX: 公共电路 -（十二专用）  (IC1.68 UCAN.4), 核心板、电源板 (IC2_核心板、电源板.68 U6_核心板、电源板.4), MCU及电源 (IC2_MCU及电源#1.68 U6_MCU及电源#1.4), MCU及电源 (IC2_MCU及电源#2.68 U6_MCU及电源#2.4), MCU及电源 (IC2_MCU及电源#3.68 U6_MCU及电源#3.4),  (IC2_.68 U6_.4), MCU及电源 (IC2_MCU及电源#4.68 U6_MCU及电源#4.4), MCU及电源 (IC2_MCU及电源#5.68 U6_MCU及电源#5.4)
CAN_TX: 公共电路 -（十二专用）  (IC1.67 UCAN.1), 核心板、电源板 (IC2_核心板、电源板.67 U6_核心板、电源板.1), MCU及电源 (IC2_MCU及电源#1.67 U6_MCU及电源#1.1), MCU及电源 (IC2_MCU及电源#2.67 U6_MCU及电源#2.1), MCU及电源 (IC2_MCU及电源#3.67 U6_MCU及电源#3.1),  (IC2_.67 U6_.1), MCU及电源 (IC2_MCU及电源#4.67 U6_MCU及电源#4.1), MCU及电源 (IC2_MCU及电源#5.67 U6_MCU及电源#5.1)
DAC1: 核心板、电源板 (IC2_核心板、电源板.39), MCU及电源 (IC2_MCU及电源#1.39), MCU及电源 (IC2_MCU及电源#2.39), MCU及电源 (IC2_MCU及电源#3.39),  (IC2_.39), 模拟量 (U10#5.3), MCU及电源 (IC2_MCU及电源#4.39), MCU及电源 (IC2_MCU及电源#5.39)
DAC2: 核心板、电源板 (IC2_核心板、电源板.40), MCU及电源 (IC2_MCU及电源#1.40), MCU及电源 (IC2_MCU及电源#2.40), MCU及电源 (IC2_MCU及电源#3.40),  (IC2_.40), 模拟量 (U10#5.12), MCU及电源 (IC2_MCU及电源#4.40), MCU及电源 (IC2_MCU及电源#5.40)
DIR1: 电机控制 (DIR.11 DIR.12 JP1.3), 四进四出三电机 (J10#6.3 R31#5.1 U10#6.6)
DIR2: 电机控制 (DIR.13 DIR.14 JP2.3), 四进四出三电机 (J10#6.6 R33#5.1 U10#6.12)
DIR3: 电机控制 (DIR.15 DIR.16 JP3.3), 四进四出三电机 (J10#6.9 R35#5.1 U11#6.6)
DIR4: 电机控制 (DIR.17 DIR.18 JP4.3), 四进四出三电机 (J10#6.12 R37#6.1 U11#6.12)
ERR_LED: 公共电路 -（十二专用）  (IC1.11 LERR.K), 核心板、电源板 (IC2_核心板、电源板.12 LED3_核心板、电源板.K), MCU及电源 (IC2_MCU及电源#1.12 LED3_MCU及电源#1.K), MCU及电源 (IC2_MCU及电源#2.12 LED3_MCU及电源#2.K), MCU及电源 (IC2_MCU及电源#3.12 LED3_MCU及电源#3.K),  (IC2_.12 LED3_.K), MCU及电源 (IC2_MCU及电源#4.12 LED3_MCU及电源#4.K), MCU及电源 (IC2_MCU及电源#5.12 LED3_MCU及电源#5.K)
In1: 十二进十二出 (RI1.1 UI1.3), 公共电路 -（十二专用）  (IC1.58)
In2: 十二进十二出 (RI2.1 UI2.3), 公共电路 -（十二专用）  (IC1.57)
In3: 十二进十二出 (RI3.1 UI3.3), 公共电路 -（十二专用）  (IC1.56)
In4: 十二进十二出 (RI4.1 UI4.3), 公共电路 -（十二专用）  (IC1.55)
IN5: 十二进十二出 (RI5.1 UI5.3), 公共电路 -（十二专用）  (IC1.54)
In6: 十二进十二出 (RI6.1 UI6.3), 公共电路 -（十二专用）  (IC1.53)
In7: 十二进十二出 (RI7.1 UI7.3), 公共电路 -（十二专用）  (IC1.52)
In8: 十二进十二出 (RI8.1 UI8.3), 公共电路 -（十二专用）  (IC1.51)
In9: 十二进十二出 (RI9.1 UI9.3), 公共电路 -（十二专用）  (IC1.30)
In10: 十二进十二出 (RI10.1 UI10.3), 公共电路 -（十二专用）  (IC1.29)
In11: 十二进十二出 (RI11.1 UI11.3), 公共电路 -（十二专用）  (IC1.28)
In12: 十二进十二出 (RI12.1 UI12.3), 公共电路 -（十二专用）  (IC1.27)
INPUT1: 八进八出 (J10#1.1 R50#1.2), 十六路输入 (J10#2.1 R50#2.2), 电机控制 (InA.3 R64#2.2), 四进四出三电机 (J11#6.7 R64#3.2)
INPUT2: 八进八出 (J10#1.2 R51#1.2), 十六路输入 (J10#2.2 R51#2.2), 电机控制 (InA.2 R65#2.2), 四进四出三电机 (J11#6.8 R65#3.2)
INPUT3: 八进八出 (J10#1.3 R52#1.2), 十六路输入 (J10#2.3 R52#2.2), 电机控制 (InA.1 R66#2.2), 四进四出三电机 (J11#6.9 R66#3.2)
INPUT4: 八进八出 (J10#1.4 R53#1.2), 十六路输入 (J10#2.4 R53#2.2), 电机控制 (InB.3 R67#2.2), 四进四出三电机 (J11#6.10 R67#3.2)
INPUT5: 八进八出 (J10#1.5 R54#1.2), 十六路输入 (J10#2.5 R54#2.2), 电机控制 (InB.2 R68#1.2), 四进四出三电机 (J11#6.11 R68#2.2)
INPUT6: 八进八出 (J10#1.6 R55#1.2), 十六路输入 (J10#2.6 R55#2.2), 电机控制 (InB.1 R69#1.2), 四进四出三电机 (J11#6.12 R69#2.2)
INPUT7: 八进八出 (J10#1.7 R56#1.2), 十六路输入 (J10#2.7 R56#2.2)
INPUT8: 八进八出 (J10#1.8 R57#1.2), 十六路输入 (J10#2.8 R57#2.2)
IO1: 八进八出 (R37#1.1 U17#1.3), 核心板、电源板 (IC2_核心板、电源板.58), 十六路输入 (LED30#2.K U20.4), MCU及电源 (IC2_MCU及电源#1.58), 十六路输出 (R70#2.1), MCU及电源 (IC2_MCU及电源#2.58), 十六继电器 (U11#3.1), MCU及电源 (IC2_MCU及电源#3.58), 电机控制 (Rd1.1),  (IC2_.58), MCU及电源 (IC2_MCU及电源#4.58), 四进四出三电机 (R47#2.1 U10#6.5), MCU及电源 (IC2_MCU及电源#5.58)
IO2: 八进八出 (R36#1.1 U16#1.3), 核心板、电源板 (IC2_核心板、电源板.57), 十六路输入 (LED31#2.K U21.4), MCU及电源 (IC2_MCU及电源#1.57), 十六路输出 (R71#2.1), MCU及电源 (IC2_MCU及电源#2.57), 十六继电器 (U11#3.2), MCU及电源 (IC2_MCU及电源#3.57), 电机控制 (Rd2.1),  (IC2_.57), MCU及电源 (IC2_MCU及电源#4.57), 四进四出三电机 (R48#2.1 U10#6.13), MCU及电源 (IC2_MCU及电源#5.57)
IO3: 八进八出 (R35#1.1 U15#1.3), 核心板、电源板 (IC2_核心板、电源板.56), 十六路输入 (LED32#2.K U22.4), MCU及电源 (IC2_MCU及电源#1.56), 十六路输出 (R72#2.1), MCU及电源 (IC2_MCU及电源#2.56), 十六继电器 (U11#3.3), MCU及电源 (IC2_MCU及电源#3.56), 电机控制 (Rd3.1),  (IC2_.56), MCU及电源 (IC2_MCU及电源#4.56), 四进四出三电机 (R49#4.1 U11#6.5), MCU及电源 (IC2_MCU及电源#5.56)
IO4: 八进八出 (R34#1.1 U14#1.3), 核心板、电源板 (IC2_核心板、电源板.55), 十六路输入 (LED33#2.K U23.4), MCU及电源 (IC2_MCU及电源#1.55), 十六路输出 (R73#2.1), MCU及电源 (IC2_MCU及电源#2.55), 十六继电器 (U11#3.4), MCU及电源 (IC2_MCU及电源#3.55), 电机控制 (Rd4.1),  (IC2_.55), MCU及电源 (IC2_MCU及电源#4.55), 四进四出三电机 (R50#4.1 U11#6.13), MCU及电源 (IC2_MCU及电源#5.55)
IO5: 八进八出 (R33#1.1 U13#1.3), 核心板、电源板 (IC2_核心板、电源板.54), 十六路输入 (LED34#2.K U24#1.4), MCU及电源 (IC2_MCU及电源#1.54), 十六路输出 (R74#2.1), MCU及电源 (IC2_MCU及电源#2.54), 十六继电器 (U11#3.5), MCU及电源 (IC2_MCU及电源#3.54), 电机控制 (R25#4.1 U26#2.3),  (IC2_.54), MCU及电源 (IC2_MCU及电源#4.54), 四进四出三电机 (R28#5.1 U29#2.3), MCU及电源 (IC2_MCU及电源#5.54)
IO6: 八进八出 (R32#1.1 U12#1.3), 核心板、电源板 (IC2_核心板、电源板.53), 十六路输入 (LED35#2.K U25#1.4), MCU及电源 (IC2_MCU及电源#1.53), 十六路输出 (R75#2.1), MCU及电源 (IC2_MCU及电源#2.53), 十六继电器 (U11#3.6), MCU及电源 (IC2_MCU及电源#3.53), 电机控制 (R26#4.1 U27#2.3),  (IC2_.53), MCU及电源 (IC2_MCU及电源#4.53), 四进四出三电机 (R27#5.1 U28#2.3), MCU及电源 (IC2_MCU及电源#5.53)
IO7: 八进八出 (R31#1.1 U11#1.3), 核心板、电源板 (IC2_核心板、电源板.52), 十六路输入 (LED36#2.K U26#1.4), MCU及电源 (IC2_MCU及电源#1.52), 十六路输出 (R76#2.1), MCU及电源 (IC2_MCU及电源#2.52), 十六继电器 (U11#3.7), MCU及电源 (IC2_MCU及电源#3.52), 电机控制 (R27#4.1 U28#1.3),  (IC2_.52), MCU及电源 (IC2_MCU及电源#4.52), 四进四出三电机 (R26#5.1 U27#3.3), MCU及电源 (IC2_MCU及电源#5.52)
IO8: 八进八出 (R30#1.1 U10#1.3), 核心板、电源板 (IC2_核心板、电源板.51), 十六路输入 (LED37#2.K U27#1.4), MCU及电源 (IC2_MCU及电源#1.51), 十六路输出 (R77#2.1), MCU及电源 (IC2_MCU及电源#2.51), 十六继电器 (U11#3.8), MCU及电源 (IC2_MCU及电源#3.51), 电机控制 (R28#4.1 U29#1.3),  (IC2_.51), MCU及电源 (IC2_MCU及电源#4.51), 四进四出三电机 (R25#5.1 U26#3.3), MCU及电源 (IC2_MCU及电源#5.51)
IO9: 八进八出 (R77#1.1), 核心板、电源板 (IC2_核心板、电源板.30), 十六路输入 (LED10#2.K U10#2.4), MCU及电源 (IC2_MCU及电源#1.30), 十六路输出 (R80#1.1), MCU及电源 (IC2_MCU及电源#2.30), 十六继电器 (U10#3.8), MCU及电源 (IC2_MCU及电源#3.30), 电机控制 (R24#4.1 U25#2.3),  (IC2_.30), MCU及电源 (IC2_MCU及电源#4.30), 四进四出三电机 (R24#5.1 U25#3.3), MCU及电源 (IC2_MCU及电源#5.30)
IO10: 八进八出 (R76#1.1), 核心板、电源板 (IC2_核心板、电源板.29), 十六路输入 (LED11#2.K U11#2.4), MCU及电源 (IC2_MCU及电源#1.29), 十六路输出 (R81.1), MCU及电源 (IC2_MCU及电源#2.29), 十六继电器 (U10#3.7), MCU及电源 (IC2_MCU及电源#3.29), 电机控制 (R23#4.1 U24#2.3),  (IC2_.29), MCU及电源 (IC2_MCU及电源#4.29), 四进四出三电机 (R23#5.1 U24#3.3), MCU及电源 (IC2_MCU及电源#5.29)
IO11: 八进八出 (R75#1.1), 核心板、电源板 (IC2_核心板、电源板.28), 十六路输入 (LED12#2.K U12#2.4), MCU及电源 (IC2_MCU及电源#1.28), 十六路输出 (R82.1), MCU及电源 (IC2_MCU及电源#2.28), 十六继电器 (U10#3.6), MCU及电源 (IC2_MCU及电源#3.28), 电机控制 (R75#3.1),  (IC2_.28), MCU及电源 (IC2_MCU及电源#4.28), 四进四出三电机 (R75#4.1), MCU及电源 (IC2_MCU及电源#5.28)
IO12: 八进八出 (R74#1.1), 核心板、电源板 (IC2_核心板、电源板.27), 十六路输入 (LED13#2.K U13#2.4), MCU及电源 (IC2_MCU及电源#1.27), 十六路输出 (R83.1), MCU及电源 (IC2_MCU及电源#2.27), 十六继电器 (U10#3.5), MCU及电源 (IC2_MCU及电源#3.27), 电机控制 (R74#3.1),  (IC2_.27), MCU及电源 (IC2_MCU及电源#4.27), 四进四出三电机 (R74#4.1), MCU及电源 (IC2_MCU及电源#5.27)
IO13: 八进八出 (R73#1.1), 核心板、电源板 (IC2_核心板、电源板.26), 十六路输入 (LED14#2.K U14#2.4), MCU及电源 (IC2_MCU及电源#1.26), 十六路输出 (R84.1), MCU及电源 (IC2_MCU及电源#2.26), 十六继电器 (U10#3.4), MCU及电源 (IC2_MCU及电源#3.26), 电机控制 (R70#3.1),  (IC2_.26), MCU及电源 (IC2_MCU及电源#4.26), 四进四出三电机 (R70#4.1), MCU及电源 (IC2_MCU及电源#5.26)
IO14: 八进八出 (R72#1.1), 核心板、电源板 (IC2_核心板、电源板.25), 十六路输入 (LED15#2.K U15#2.4), MCU及电源 (IC2_MCU及电源#1.25), 十六路输出 (R85.1), MCU及电源 (IC2_MCU及电源#2.25), 十六继电器 (U10#3.3), MCU及电源 (IC2_MCU及电源#3.25), 电机控制 (R71#3.1),  (IC2_.25), MCU及电源 (IC2_MCU及电源#4.25), 四进四出三电机 (R71#4.1), MCU及电源 (IC2_MCU及电源#5.25)
IO15: 八进八出 (R71#1.1), 核心板、电源板 (IC2_核心板、电源板.24), 十六路输入 (LED16#2.K U16#2.4), MCU及电源 (IC2_MCU及电源#1.24), 十六路输出 (R86.1), MCU及电源 (IC2_MCU及电源#2.24), 十六继电器 (U10#3.2), MCU及电源 (IC2_MCU及电源#3.24), 电机控制 (R72#3.1),  (IC2_.24), MCU及电源 (IC2_MCU及电源#4.24), 四进四出三电机 (R72#4.1), MCU及电源 (IC2_MCU及电源#5.24)
IO16: 八进八出 (R70#1.1), 核心板、电源板 (IC2_核心板、电源板.23), 十六路输入 (LED17#2.K U17#2.4), MCU及电源 (IC2_MCU及电源#1.23), 十六路输出 (R87.1), MCU及电源 (IC2_MCU及电源#2.23), 十六继电器 (U10#3.1), MCU及电源 (IC2_MCU及电源#3.23), 电机控制 (R73#3.1),  (IC2_.23), MCU及电源 (IC2_MCU及电源#4.23), 四进四出三电机 (R73#4.1), MCU及电源 (IC2_MCU及电源#5.23)
NRST: 公共电路 -（十二专用）  (IC1.4 S2.1), 核心板 (J1#2.4 R16#2.1 U6.14 U7.2), 核心板、电源板 (IC2_核心板、电源板.4 S2_核心板、电源板.1), MCU及电源 (IC2_MCU及电源#1.4 S2_MCU及电源#1.1), MCU及电源 (IC2_MCU及电源#2.4 S2_MCU及电源#2.1), MCU及电源 (IC2_MCU及电源#3.4 S2_MCU及电源#3.1),  (IC2_.4 S2_.1), MCU及电源 (IC2_MCU及电源#4.4 S2_MCU及电源#4.1), MCU及电源 (IC2_MCU及电源#5.4 S2_MCU及电源#5.1)
Out1: 十二进十二出 (RO13.1), 公共电路 -（十二专用）  (IC1.49)
Out2: 十二进十二出 (RO14.1), 公共电路 -（十二专用）  (IC1.50)
Out3: 十二进十二出 (RO15.1), 公共电路 -（十二专用）  (IC1.47)
Out4: 十二进十二出 (RO16.1), 公共电路 -（十二专用）  (IC1.48)
Out5: 十二进十二出 (RO17.1), 公共电路 -（十二专用）  (IC1.36)
Out6: 十二进十二出 (RO18.1), 公共电路 -（十二专用）  (IC1.35)
Out7: 十二进十二出 (RO19.1), 公共电路 -（十二专用）  (IC1.41)
Out8: 十二进十二出 (RO20.1), 公共电路 -（十二专用）  (IC1.44)
Out9: 十二进十二出 (RO21.1), 公共电路 -（十二专用）  (IC1.26)
Out10: 十二进十二出 (RO22.1), 公共电路 -（十二专用）  (IC1.25)
Out11: 十二进十二出 (RO23.1), 公共电路 -（十二专用）  (IC1.24)
Out12: 十二进十二出 (RO24.1), 公共电路 -（十二专用）  (IC1.23)
OUTPUT1: 八进八出 (J11#1.2 U34#1.11 U34#1.12), 十六路输出 (J11#3.2 U34#2.11 U34#2.12), 电机控制 (OutA.1 U34#3.11 U34#3.12), 四进四出三电机 (J11#6.1 U34#4.11 U34#4.12)
OUTPUT2: 八进八出 (J11#1.3 U34#1.13 U34#1.14), 十六路输出 (J11#3.3 U34#2.13 U34#2.14), 电机控制 (OutA.2 U34#3.13 U34#3.14), 四进四出三电机 (J11#6.2 U34#4.13 U34#4.14)
OUTPUT3: 八进八出 (J11#1.4 U34#1.15 U34#1.16), 十六路输出 (J11#3.4 U34#2.15 U34#2.16), 电机控制 (OutA.3 U34#3.15 U34#3.16), 四进四出三电机 (J11#6.3 U34#4.15 U34#4.16)
OUTPUT4: 八进八出 (J11#1.5 U34#1.17 U34#1.18), 十六路输出 (J11#3.5 U34#2.17 U34#2.18), 电机控制 (OutB.1 U34#3.17 U34#3.18), 四进四出三电机 (J11#6.4 U34#4.17 U34#4.18)
OUTPUT5: 八进八出 (J11#1.6 U39#1.11 U39#1.12), 十六路输出 (J11#3.6 U39#2.11 U39#2.12), 电机控制 (OutB.2 U39#3.15 U39#3.16), 四进四出三电机 (J11#6.5 U39#4.15 U39#4.16)
OUTPUT6: 八进八出 (J11#1.7 U39#1.13 U39#1.14), 十六路输出 (J11#3.7 U39#2.13 U39#2.14), 电机控制 (OutB.3 U39#3.17 U39#3.18), 四进四出三电机 (J11#6.6 U39#4.17 U39#4.18)
OUTPUT7: 八进八出 (J11#1.8 U39#1.15 U39#1.16), 十六路输出 (J11#3.8 U39#2.15 U39#2.16)
OUTPUT8: 八进八出 (J11#1.9 U39#1.17 U39#1.18), 十六路输出 (J11#3.9 U39#2.17 U39#2.18)
PD10: 公共电路 -（十二专用）  (IC1.13 R8.1), 核心板 (J1#2.13 U6.57), 核心板、电源板 (IC2_核心板、电源板.13 R8_核心板、电源板.1), MCU及电源 (IC2_MCU及电源#1.13 R8_MCU及电源#1.1), MCU及电源 (IC2_MCU及电源#2.13 R8_MCU及电源#2.1), MCU及电源 (IC2_MCU及电源#3.13 R8_MCU及电源#3.1),  (IC2_.13 R8_.1), MCU及电源 (IC2_MCU及电源#4.13 R8_MCU及电源#4.1), MCU及电源 (IC2_MCU及电源#5.13 R8_MCU及电源#5.1)
PD11: 公共电路 -（十二专用）  (IC1.62), 核心板 (J1#2.62 U6.58)
PWM1: 核心板、电源板 (IC2_核心板、电源板.45), MCU及电源 (IC2_MCU及电源#1.45), MCU及电源 (IC2_MCU及电源#2.45), MCU及电源 (IC2_MCU及电源#3.45), 电机控制 (R37#4.1 U10#4.1),  (IC2_.45), MCU及电源 (IC2_MCU及电源#4.45), 四进四出三电机 (R43#2.1 U10#6.1), MCU及电源 (IC2_MCU及电源#5.45)
PWM1+: 电机控制 (JP1.1 R30#4.1 U10#4.4), 四进四出三电机 (J10#6.1 R30#6.1 U10#6.4)
PWM1-: 电机控制 (JP1.2 U10#4.2 U10#4.3), 四进四出三电机 (J10#6.2 U10#6.2 U10#6.3)
PWM2: 核心板、电源板 (IC2_核心板、电源板.46), MCU及电源 (IC2_MCU及电源#1.46), MCU及电源 (IC2_MCU及电源#2.46), MCU及电源 (IC2_MCU及电源#3.46), 电机控制 (R38#2.1 U10#4.13),  (IC2_.46), MCU及电源 (IC2_MCU及电源#4.46), 四进四出三电机 (R44#2.1 U10#6.9), MCU及电源 (IC2_MCU及电源#5.46)
PWM2+: 电机控制 (JP2.1 R32#4.1 U10#4.10), 四进四出三电机 (J10#6.4 R32#6.1 U10#6.10)
PWM2-: 电机控制 (JP2.2 U10#4.11 U10#4.12), 四进四出三电机 (J10#6.5 U10#6.8 U10#6.11)
PWM3: 核心板、电源板 (IC2_核心板、电源板.43), MCU及电源 (IC2_MCU及电源#1.43), MCU及电源 (IC2_MCU及电源#2.43), MCU及电源 (IC2_MCU及电源#3.43), 电机控制 (R39#2.1 U11#4.1),  (IC2_.43), MCU及电源 (IC2_MCU及电源#4.43), 四进四出三电机 (R45#2.1 U11#6.1), MCU及电源 (IC2_MCU及电源#5.43)
PWM3+: 电机控制 (JP3.1 R34#4.1 U11#4.4), 四进四出三电机 (J10#6.7 R34#6.1 U11#6.4)
PWM3-: 电机控制 (JP3.2 U11#4.2 U11#4.3), 四进四出三电机 (J10#6.8 U11#6.2 U11#6.3)
PWM4: 核心板、电源板 (IC2_核心板、电源板.44), MCU及电源 (IC2_MCU及电源#1.44), MCU及电源 (IC2_MCU及电源#2.44), MCU及电源 (IC2_MCU及电源#3.44), 电机控制 (R40#1.1 U11#4.13),  (IC2_.44), MCU及电源 (IC2_MCU及电源#4.44), 四进四出三电机 (R46#2.1 U11#6.9), MCU及电源 (IC2_MCU及电源#5.44)
PWM4+: 电机控制 (JP4.1 R36#4.1 U11#4.10), 四进四出三电机 (J10#6.10 R36#6.1 U11#6.10)
PWM4-: 电机控制 (JP4.2 U11#4.11 U11#4.12), 四进四出三电机 (J10#6.11 U11#6.8 U11#6.11)
RJ45_RX: 核心板、电源板 (RJ45_核心板、电源板.3 U4.8), MCU及电源 (RJ45_MCU及电源#1.3 U4_MCU及电源#1.8), MCU及电源 (RJ45_MCU及电源#2.3 U4_MCU及电源#2.8), MCU及电源 (RJ45_MCU及电源#3.3 U4_MCU及电源#3.8),  (RJ45_.3 U4_.8), MCU及电源 (RJ45_MCU及电源#4.3 U4_MCU及电源#4.8), MCU及电源 (RJ45_MCU及电源#5.3 U4_MCU及电源#5.8)
RJ45_TX: 核心板、电源板 (RJ45_核心板、电源板.2 U4.7), MCU及电源 (RJ45_MCU及电源#1.2 U4_MCU及电源#1.7), MCU及电源 (RJ45_MCU及电源#2.2 U4_MCU及电源#2.7), MCU及电源 (RJ45_MCU及电源#3.2 U4_MCU及电源#3.7),  (RJ45_.2 U4_.7), MCU及电源 (RJ45_MCU及电源#4.2 U4_MCU及电源#4.7), MCU及电源 (RJ45_MCU及电源#5.2 U4_MCU及电源#5.7)
RS232_RX: 核心板、电源板 (RS232_核心板、电源板.1 U4.13), MCU及电源 (RS232_MCU及电源#1.1 U4_MCU及电源#1.13), MCU及电源 (RS232_MCU及电源#2.1 U4_MCU及电源#2.13), MCU及电源 (RS232_MCU及电源#3.1 U4_MCU及电源#3.13),  (RS232_.1 U4_.13), MCU及电源 (RS232_MCU及电源#4.1 U4_MCU及电源#4.13), MCU及电源 (RS232_MCU及电源#5.1 U4_MCU及电源#5.13)
RS232_TX: 核心板、电源板 (RS232_核心板、电源板.2 U4.14), MCU及电源 (RS232_MCU及电源#1.2 U4_MCU及电源#1.14), MCU及电源 (RS232_MCU及电源#2.2 U4_MCU及电源#2.14), MCU及电源 (RS232_MCU及电源#3.2 U4_MCU及电源#3.14),  (RS232_.2 U4_.14), MCU及电源 (RS232_MCU及电源#4.2 U4_MCU及电源#4.14), MCU及电源 (RS232_MCU及电源#5.2 U4_MCU及电源#5.14)
RUN_LED: 公共电路 -（十二专用）  (IC1.12 LRUN.K), 核心板、电源板 (IC2_核心板、电源板.11 LED2_核心板、电源板.K), MCU及电源 (IC2_MCU及电源#1.11 LED2_MCU及电源#1.K), MCU及电源 (IC2_MCU及电源#2.11 LED2_MCU及电源#2.K), MCU及电源 (IC2_MCU及电源#3.11 LED2_MCU及电源#3.K),  (IC2_.11 LED2_.K), MCU及电源 (IC2_MCU及电源#4.11 LED2_MCU及电源#4.K), MCU及电源 (IC2_MCU及电源#5.11 LED2_MCU及电源#5.K)
RX1: 公共电路 -（十二专用）  (IC1.10 J1#1.3 R4.1), 核心板 (J1#2.10 U6.69), 核心板、电源板 (IC2_核心板、电源板.10 R3_核心板、电源板.1), MCU及电源 (IC2_MCU及电源#1.10 R3_MCU及电源#1.1), MCU及电源 (IC2_MCU及电源#2.10 R3_MCU及电源#2.1), MCU及电源 (IC2_MCU及电源#3.10 R3_MCU及电源#3.1),  (IC2_.10 R3_.1), MCU及电源 (IC2_MCU及电源#4.10 R3_MCU及电源#4.1), MCU及电源 (IC2_MCU及电源#5.10 R3_MCU及电源#5.1)
RX2: 公共电路 -（十二专用）  (IC1.18 R6.1), 核心板 (J1#2.18 U6.26), 核心板、电源板 (IC2_核心板、电源板.18 R6_核心板、电源板.1), MCU及电源 (IC2_MCU及电源#1.18 R6_MCU及电源#1.1), MCU及电源 (IC2_MCU及电源#2.18 R6_MCU及电源#2.1), MCU及电源 (IC2_MCU及电源#3.18 R6_MCU及电源#3.1),  (IC2_.18 R6_.1), MCU及电源 (IC2_MCU及电源#4.18 R6_MCU及电源#4.1), MCU及电源 (IC2_MCU及电源#5.18 R6_MCU及电源#5.1)
RX3: 公共电路 -（十二专用）  (IC1.20 R7.1), 核心板 (J1#2.20 U6.56), 核心板、电源板 (IC2_核心板、电源板.20 R7_核心板、电源板.1), MCU及电源 (IC2_MCU及电源#1.20 R7_MCU及电源#1.1), MCU及电源 (IC2_MCU及电源#2.20 R7_MCU及电源#2.1), MCU及电源 (IC2_MCU及电源#3.20 R7_MCU及电源#3.1),  (IC2_.20 R7_.1), MCU及电源 (IC2_MCU及电源#4.20 R7_MCU及电源#4.1), MCU及电源 (IC2_MCU及电源#5.20 R7_MCU及电源#5.1)
RX4: 公共电路 -（十二专用）  (IC1.80 J4.3), 核心板、电源板 (COM4#2.3 IC2_核心板、电源板.80), MCU及电源 (IC2_MCU及电源#1.80 USART_MCU及电源#1.3), MCU及电源 (IC2_MCU及电源#2.80 USART_MCU及电源#2.3), MCU及电源 (IC2_MCU及电源#3.80 USART_MCU及电源#3.3),  (IC2_.80 USART_.3), MCU及电源 (IC2_MCU及电源#4.80 USART_MCU及电源#4.3), MCU及电源 (IC2_MCU及电源#5.80 USART_MCU及电源#5.3)
SPI3_CE: 公共电路 -（十二专用）  (IC1.60 J7.3), 核心板、电源板 (IC2_核心板、电源板.60 J7_核心板、电源板.3), MCU及电源 (IC2_MCU及电源#1.60 J7_MCU及电源#1.3), MCU及电源 (IC2_MCU及电源#2.60 J7_MCU及电源#2.3), MCU及电源 (IC2_MCU及电源#3.60 J7_MCU及电源#3.3),  (IC2_.60 J7_.3), MCU及电源 (IC2_MCU及电源#4.60 J7_MCU及电源#4.3), MCU及电源 (IC2_MCU及电源#5.60 J7_MCU及电源#5.3)
SPI3_CLK: 公共电路 -（十二专用）  (IC1.73 J7.5), 核心板、电源板 (IC2_核心板、电源板.73 J7_核心板、电源板.5), MCU及电源 (IC2_MCU及电源#1.73 J7_MCU及电源#1.5), MCU及电源 (IC2_MCU及电源#2.73 J7_MCU及电源#2.5), MCU及电源 (IC2_MCU及电源#3.73 J7_MCU及电源#3.5),  (IC2_.73 J7_.5), MCU及电源 (IC2_MCU及电源#4.73 J7_MCU及电源#4.5), MCU及电源 (IC2_MCU及电源#5.73 J7_MCU及电源#5.5)
SPI3_CS: 公共电路 -（十二专用）  (IC1.74 J7.4), 核心板、电源板 (IC2_核心板、电源板.74 J7_核心板、电源板.4), MCU及电源 (IC2_MCU及电源#1.74 J7_MCU及电源#1.4), MCU及电源 (IC2_MCU及电源#2.74 J7_MCU及电源#2.4), MCU及电源 (IC2_MCU及电源#3.74 J7_MCU及电源#3.4),  (IC2_.74 J7_.4), MCU及电源 (IC2_MCU及电源#4.74 J7_MCU及电源#4.4), MCU及电源 (IC2_MCU及电源#5.74 J7_MCU及电源#5.4)
SPI3_IRQ: 公共电路 -（十二专用）  (IC1.59 J7.8), 核心板、电源板 (IC2_核心板、电源板.59 J7_核心板、电源板.8), MCU及电源 (IC2_MCU及电源#1.59 J7_MCU及电源#1.8), MCU及电源 (IC2_MCU及电源#2.59 J7_MCU及电源#2.8), MCU及电源 (IC2_MCU及电源#3.59 J7_MCU及电源#3.8),  (IC2_.59 J7_.8), MCU及电源 (IC2_MCU及电源#4.59 J7_MCU及电源#4.8), MCU及电源 (IC2_MCU及电源#5.59 J7_MCU及电源#5.8)
SPI3_MISO: 公共电路 -（十二专用）  (IC1.72 J7.7), 核心板、电源板 (IC2_核心板、电源板.72 J7_核心板、电源板.7), MCU及电源 (IC2_MCU及电源#1.72 J7_MCU及电源#1.7), MCU及电源 (IC2_MCU及电源#2.72 J7_MCU及电源#2.7), MCU及电源 (IC2_MCU及电源#3.72 J7_MCU及电源#3.7),  (IC2_.72 J7_.7), MCU及电源 (IC2_MCU及电源#4.72 J7_MCU及电源#4.7), MCU及电源 (IC2_MCU及电源#5.72 J7_MCU及电源#5.7)
SPI3_MOSI: 公共电路 -（十二专用）  (IC1.71 J7.6), 核心板、电源板 (IC2_核心板、电源板.71 J7_核心板、电源板.6), MCU及电源 (IC2_MCU及电源#1.71 J7_MCU及电源#1.6), MCU及电源 (IC2_MCU及电源#2.71 J7_MCU及电源#2.6), MCU及电源 (IC2_MCU及电源#3.71 J7_MCU及电源#3.6),  (IC2_.71 J7_.6), MCU及电源 (IC2_MCU及电源#4.71 J7_MCU及电源#4.6), MCU及电源 (IC2_MCU及电源#5.71 J7_MCU及电源#5.6)
SW1: 公共电路 -（十二专用）  (IC1.39 S1.1), 核心板、电源板 (IC2_核心板、电源板.66 K1_核心板、电源板.1), MCU及电源 (IC2_MCU及电源#1.66 K1_MCU及电源#1.1), MCU及电源 (IC2_MCU及电源#2.66 K1_MCU及电源#2.1), MCU及电源 (IC2_MCU及电源#3.66 K1_MCU及电源#3.1),  (IC2_.66 K1_.1), MCU及电源 (IC2_MCU及电源#4.66 K1_MCU及电源#4.1), MCU及电源 (IC2_MCU及电源#5.66 K1_MCU及电源#5.1)
SW2: 公共电路 -（十二专用）  (IC1.40 S1.2), 核心板、电源板 (IC2_核心板、电源板.65 K1_核心板、电源板.2), MCU及电源 (IC2_MCU及电源#1.65 K1_MCU及电源#1.2), MCU及电源 (IC2_MCU及电源#2.65 K1_MCU及电源#2.2), MCU及电源 (IC2_MCU及电源#3.65 K1_MCU及电源#3.2),  (IC2_.65 K1_.2), MCU及电源 (IC2_MCU及电源#4.65 K1_MCU及电源#4.2), MCU及电源 (IC2_MCU及电源#5.65 K1_MCU及电源#5.2)
SW3: 公共电路 -（十二专用）  (IC1.37 S1.3), 核心板、电源板 (IC2_核心板、电源板.64 K1_核心板、电源板.3), MCU及电源 (IC2_MCU及电源#1.64 K1_MCU及电源#1.3), MCU及电源 (IC2_MCU及电源#2.64 K1_MCU及电源#2.3), MCU及电源 (IC2_MCU及电源#3.64 K1_MCU及电源#3.3),  (IC2_.64 K1_.3), MCU及电源 (IC2_MCU及电源#4.64 K1_MCU及电源#4.3), MCU及电源 (IC2_MCU及电源#5.64 K1_MCU及电源#5.3)
SW4: 公共电路 -（十二专用）  (IC1.38 S1.4), 核心板、电源板 (IC2_核心板、电源板.63 K1_核心板、电源板.4), MCU及电源 (IC2_MCU及电源#1.63 K1_MCU及电源#1.4), MCU及电源 (IC2_MCU及电源#2.63 K1_MCU及电源#2.4), MCU及电源 (IC2_MCU及电源#3.63 K1_MCU及电源#3.4),  (IC2_.63 K1_.4), MCU及电源 (IC2_MCU及电源#4.63 K1_MCU及电源#4.4), MCU及电源 (IC2_MCU及电源#5.63 K1_MCU及电源#5.4)
SW5: 核心板、电源板 (IC2_核心板、电源板.62), MCU及电源 (IC2_MCU及电源#1.62), MCU及电源 (IC2_MCU及电源#2.62), MCU及电源 (IC2_MCU及电源#3.62),  (IC2_.62), MCU及电源 (IC2_MCU及电源#4.62), MCU及电源 (IC2_MCU及电源#5.62)
SW6: 核心板、电源板 (IC2_核心板、电源板.61), MCU及电源 (IC2_MCU及电源#1.61), MCU及电源 (IC2_MCU及电源#2.61), MCU及电源 (IC2_MCU及电源#3.61),  (IC2_.61), MCU及电源 (IC2_MCU及电源#4.61), MCU及电源 (IC2_MCU及电源#5.61)
SWDCK: 公共电路 -（十二专用）  (IC1.6 J5.2), 核心板 (J1#2.6 U6.76), 核心板、电源板 (IC2_核心板、电源板.6 J2_核心板、电源板.3), MCU及电源 (IC2_MCU及电源#1.6 J2_MCU及电源#1.3), MCU及电源 (IC2_MCU及电源#2.6 J2_MCU及电源#2.3), MCU及电源 (IC2_MCU及电源#3.6 J2_MCU及电源#3.3),  (IC2_.6 J2_.3), MCU及电源 (IC2_MCU及电源#4.6 J2_MCU及电源#4.3), MCU及电源 (IC2_MCU及电源#5.6 J2_MCU及电源#5.3)
SWDIO: 公共电路 -（十二专用）  (IC1.5 J5.1), 核心板 (J1#2.5 U6.72), 核心板、电源板 (IC2_核心板、电源板.5 J2_核心板、电源板.2), MCU及电源 (IC2_MCU及电源#1.5 J2_MCU及电源#1.2), MCU及电源 (IC2_MCU及电源#2.5 J2_MCU及电源#2.2), MCU及电源 (IC2_MCU及电源#3.5 J2_MCU及电源#3.2),  (IC2_.5 J2_.2), MCU及电源 (IC2_MCU及电源#4.5 J2_MCU及电源#4.2), MCU及电源 (IC2_MCU及电源#5.5 J2_MCU及电源#5.2)
TX1: 公共电路 -（十二专用）  (IC1.9 J1#1.2 TM1.1), 核心板 (J1#2.9 U6.68), 核心板、电源板 (IC2_核心板、电源板.9 R4_核心板、电源板.1), MCU及电源 (IC2_MCU及电源#1.9 R4_MCU及电源#1.1), MCU及电源 (IC2_MCU及电源#2.9 R4_MCU及电源#2.1), MCU及电源 (IC2_MCU及电源#3.9 R4_MCU及电源#3.1),  (IC2_.9 R4_.1), MCU及电源 (IC2_MCU及电源#4.9 R4_MCU及电源#4.1), MCU及电源 (IC2_MCU及电源#5.9 R4_MCU及电源#5.1)
TX2: 公共电路 -（十二专用）  (IC1.17 R5.1), 核心板 (J1#2.17 U6.25), 核心板、电源板 (IC2_核心板、电源板.17 R5_核心板、电源板.1), MCU及电源 (IC2_MCU及电源#1.17 R5_MCU及电源#1.1), MCU及电源 (IC2_MCU及电源#2.17 R5_MCU及电源#2.1), MCU及电源 (IC2_MCU及电源#3.17 R5_MCU及电源#3.1),  (IC2_.17 R5_.1), MCU及电源 (IC2_MCU及电源#4.17 R5_MCU及电源#4.1), MCU及电源 (IC2_MCU及电源#5.17 R5_MCU及电源#5.1)
TX3: 公共电路 -（十二专用）  (IC1.19 R9.1), 核心板 (J1#2.19 U6.55), 核心板、电源板 (IC2_核心板、电源板.19 R9_核心板、电源板.1), MCU及电源 (IC2_MCU及电源#1.19 R9_MCU及电源#1.1), MCU及电源 (IC2_MCU及电源#2.19 R9_MCU及电源#2.1), MCU及电源 (IC2_MCU及电源#3.19 R9_MCU及电源#3.1),  (IC2_.19 R9_.1), MCU及电源 (IC2_MCU及电源#4.19 R9_MCU及电源#4.1), MCU及电源 (IC2_MCU及电源#5.19 R9_MCU及电源#5.1)
TX4: 公共电路 -（十二专用）  (IC1.79 J4.2), 核心板、电源板 (COM4#2.2 IC2_核心板、电源板.79), MCU及电源 (IC2_MCU及电源#1.79 USART_MCU及电源#1.2), MCU及电源 (IC2_MCU及电源#2.79 USART_MCU及电源#2.2), MCU及电源 (IC2_MCU及电源#3.79 USART_MCU及电源#3.2),  (IC2_.79 USART_.2), MCU及电源 (IC2_MCU及电源#4.79 USART_MCU及电源#4.2), MCU及电源 (IC2_MCU及电源#5.79 USART_MCU及电源#5.2)
USB_D+: 公共电路 -（十二专用）  (IC1.8 USB1.3), 核心板 (J1#2.8 R18.1 R19.2), 核心板、电源板 (IC2_核心板、电源板.8 USB1_核心板、电源板.3), MCU及电源 (IC2_MCU及电源#1.8 USB1_MCU及电源#1.3), MCU及电源 (IC2_MCU及电源#2.8 USB1_MCU及电源#2.3), MCU及电源 (IC2_MCU及电源#3.8 USB1_MCU及电源#3.3),  (IC2_.8 USB1_.3), MCU及电源 (IC2_MCU及电源#4.8 USB1_MCU及电源#4.3), MCU及电源 (IC2_MCU及电源#5.8 USB1_MCU及电源#5.3)
USB_D-: 公共电路 -（十二专用）  (IC1.7 USB1.2), 核心板 (J1#2.7 R20.2), 核心板、电源板 (IC2_核心板、电源板.7 USB1_核心板、电源板.2), MCU及电源 (IC2_MCU及电源#1.7 USB1_MCU及电源#1.2), MCU及电源 (IC2_MCU及电源#2.7 USB1_MCU及电源#2.2), MCU及电源 (IC2_MCU及电源#3.7 USB1_MCU及电源#3.2),  (IC2_.7 USB1_.2), MCU及电源 (IC2_MCU及电源#4.7 USB1_MCU及电源#4.2), MCU及电源 (IC2_MCU及电源#5.7 USB1_MCU及电源#5.2)